# EasyEDA Pro project ProProject_FPGA Dev Board - ICE40HX4K-TQ144 v0.03_2024-02-22 - EASYEDA PRO PROJECT.epro, board PCB ICE40
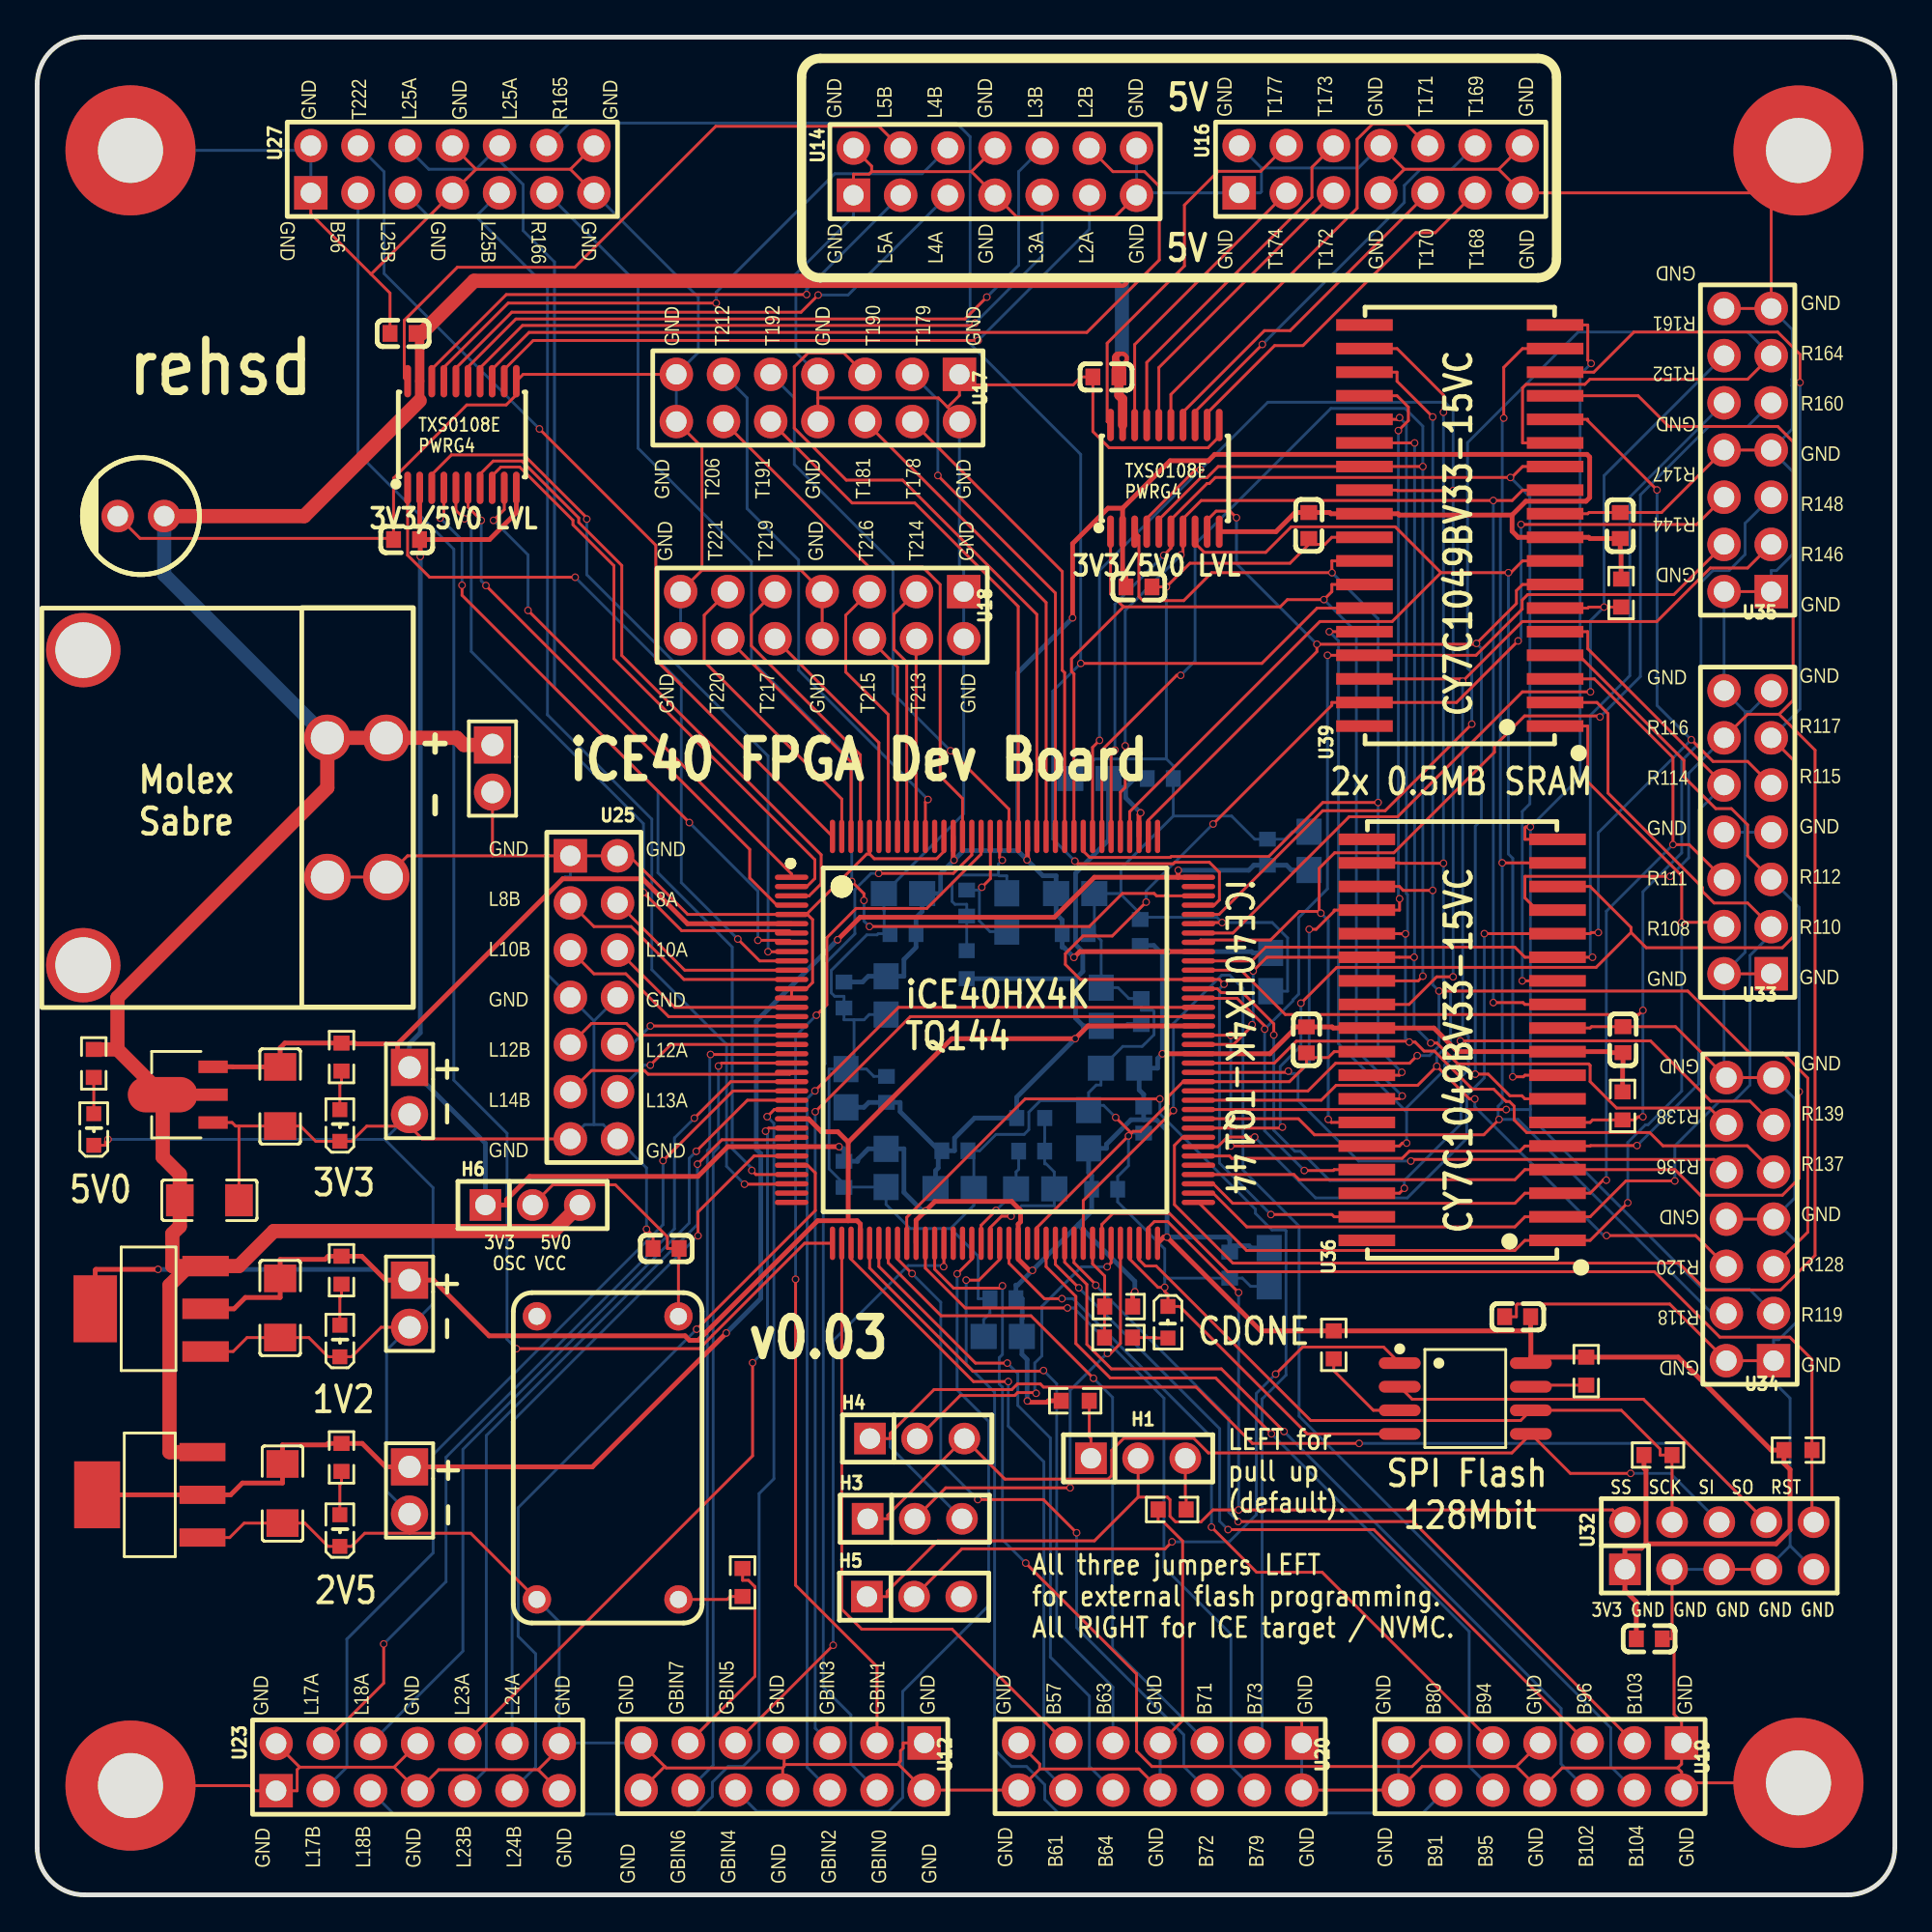
[diagram p1: board, top side]
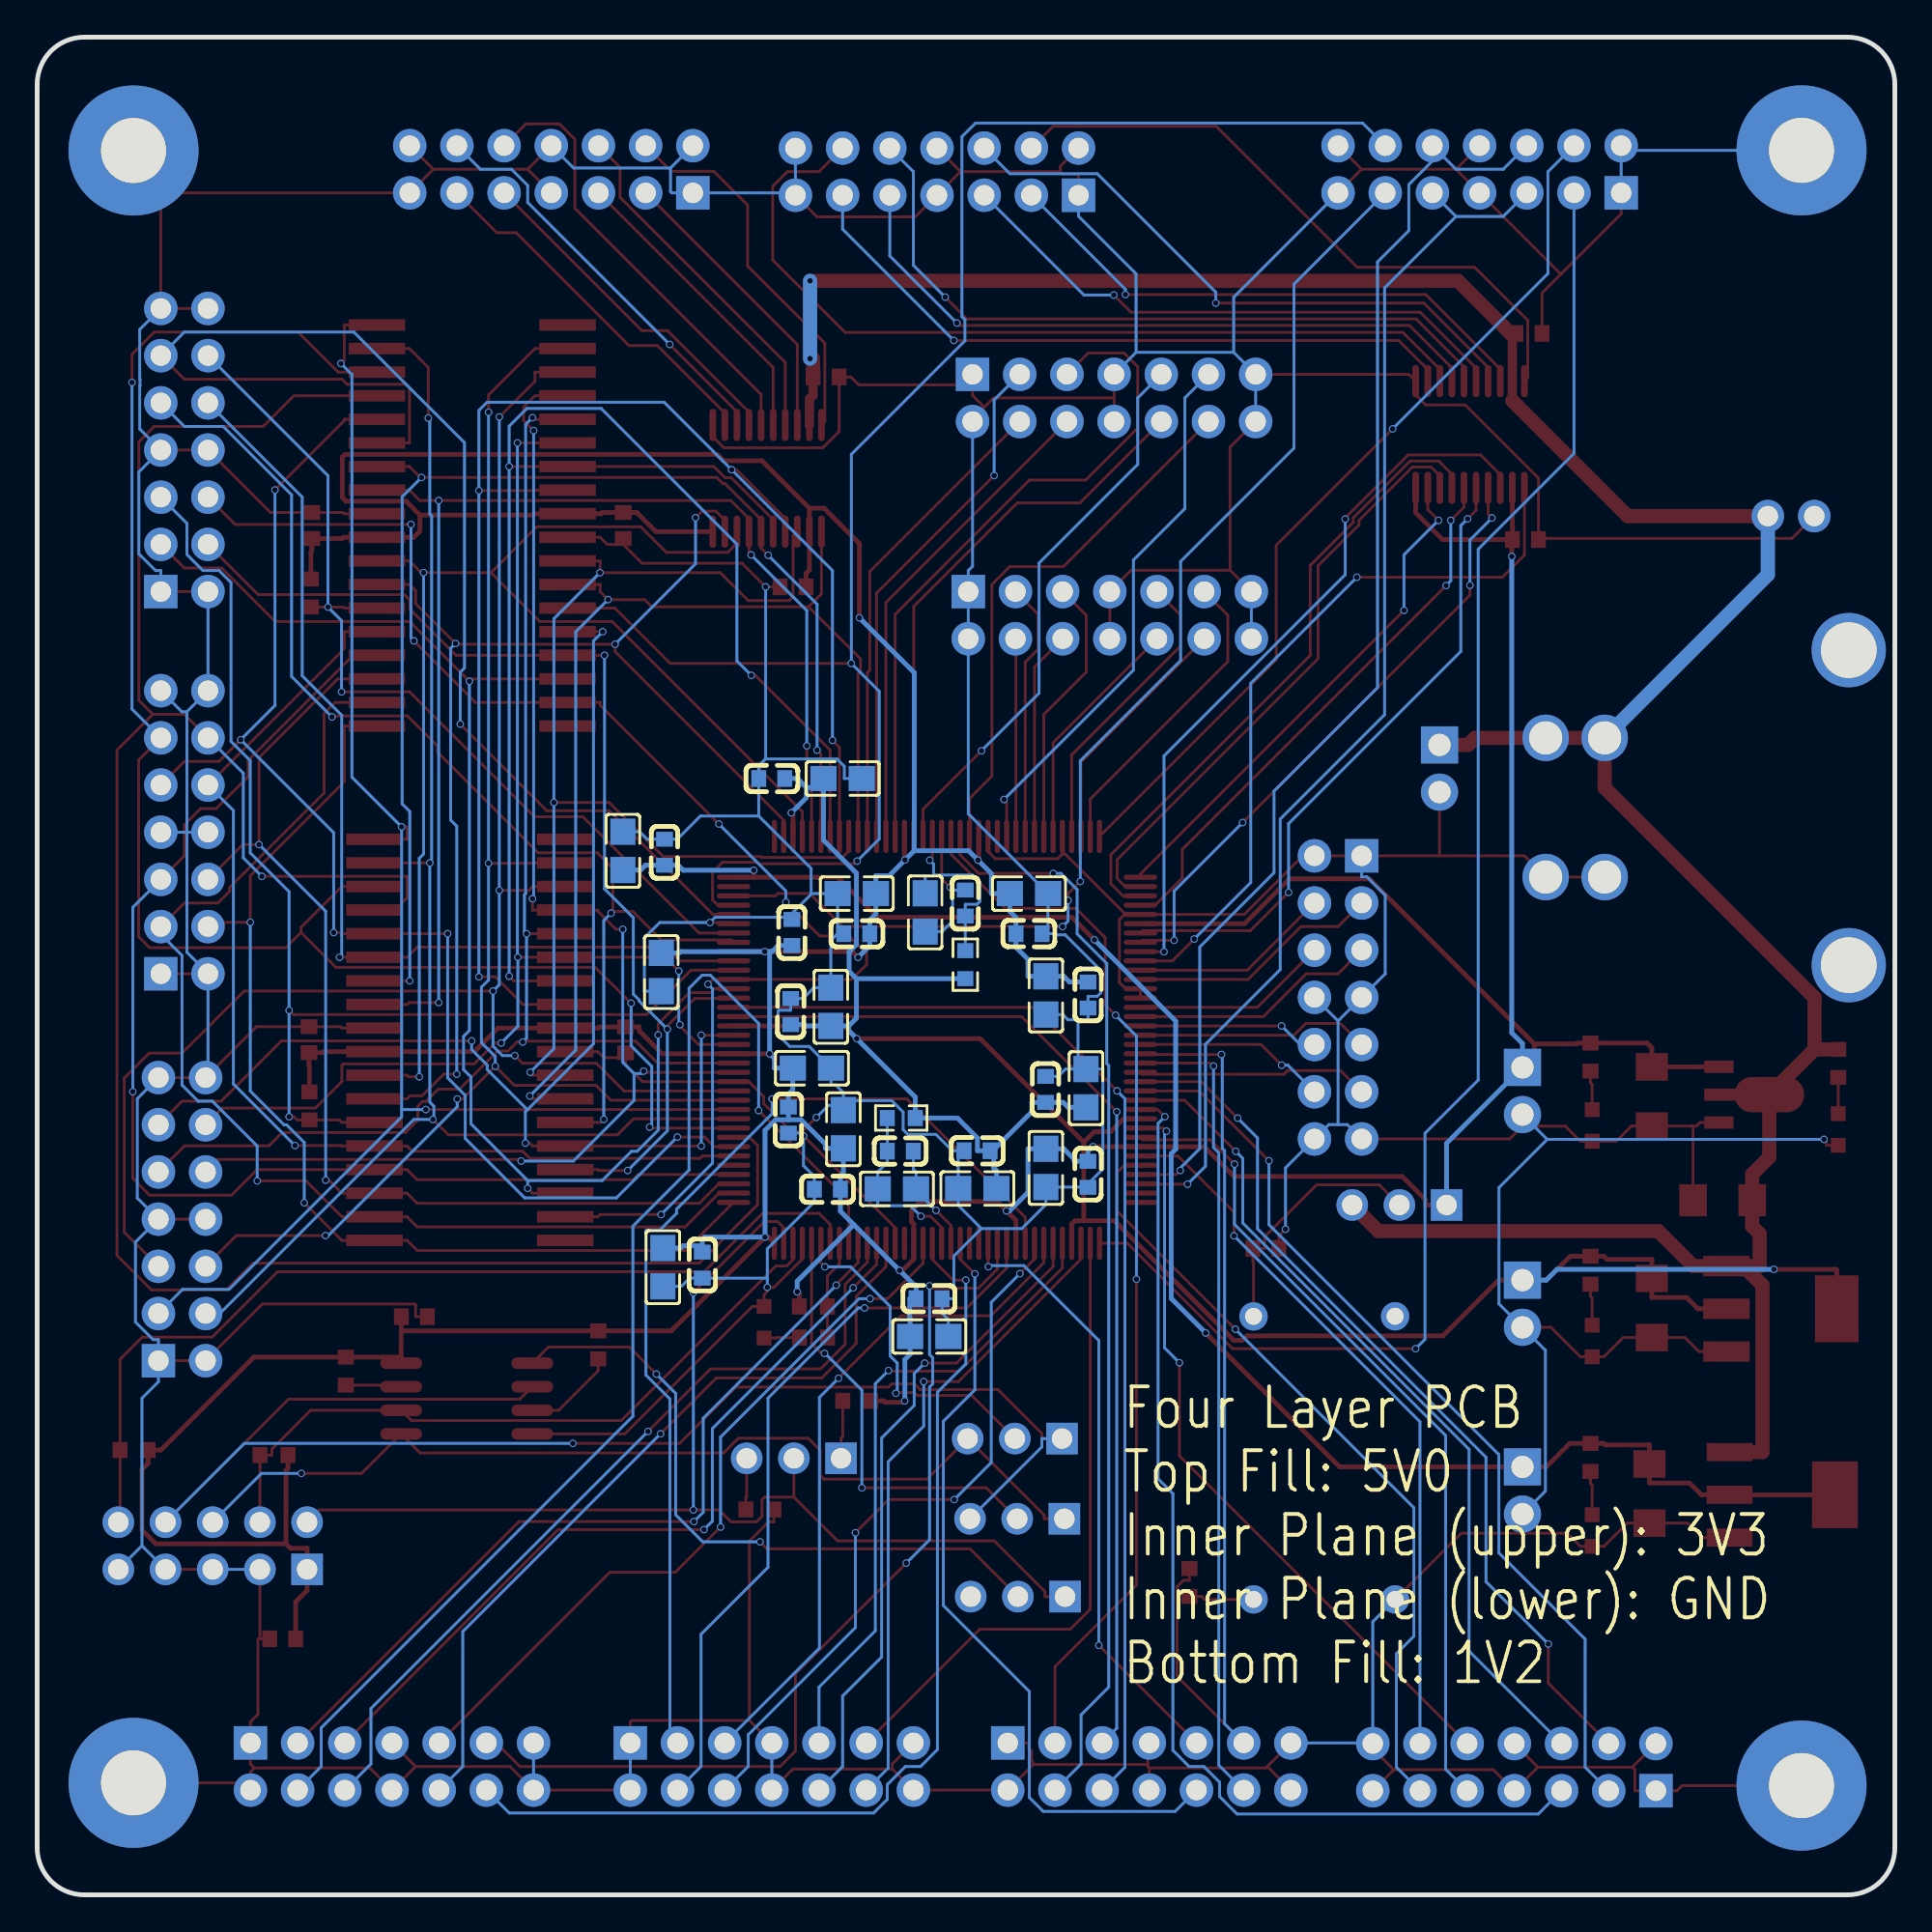
[diagram p2: board, bottom side, seen from below]

Outline 100 x 100 mm; copper layers: Top Layer, 3V3, GND, Bottom Layer. Coordinates in mm from the lower left corner of the outline.
Outline path: 0,97.46 0,2.54 arc(0.74,0.74) 2.54,0 97.46,0 arc(99.26,0.74) 100,2.54 100,97.46 arc(99.26,99.26) 97.46,100 2.54,100 arc(0.74,99.26) 0,97.46
Stack: Top Layer 0.035mm 外层铜厚1oz / Dielectric1 0.2104mm 7628 RC49% 8.6mil / 3V3 0.0152mm 内层铜厚 / Dielectric2 1.065mm 1.1mm H/HOZ 含铜 / GND 0.0152mm 内层铜厚 / Dielectric3 0.2104mm 7628 RC49% 8.6mil / Bottom Layer 0.035mm 外层铜厚1oz

## Design rules (mm)
template: Custom Config
spacing copperThickness1oz (default): track to track 0.152, other pairs 0.152 to 0.3
spacing copperThickness2oz: track to track 0.203, other pairs 0.152 to 0.3
track width copperThickness1oz (default): min 0.127, default 0.152, max 2.54
track width copperThickness2oz: min 0.203, default 0.254, max 2.54
track width 5V0: min 0.127, default 0.762, max 2.54
track width 3V3: min 0.127, default 0.254, max 2.54
track width 1V2: min 0.127, default 0.254, max 2.54
track width 2V5: min 0.127, default 0.254, max 2.54
differential pair differentialPair (default): width min 0.127, default 0.254, max 2.54; gap min 0.152, default 0.152
via viaSize (default): diameter min 0.4, default 0.4, max 10; hole min 0.3, default 0.3, max 6.3
net 3V3 uses 3V3
net 1V2 uses 1V2
net 2V5 uses 2V5
net 5V0 uses 5V0

## Placement (name value [footprint] x y rotation side)
C1  4.7uF  [C0805]  56.64 60.09 0 bottom
C2  0.1uF  [C0603]  60.46 60.09 0 bottom
C3  4.7uF  [C0805]  46.61 53.9 0 bottom
C4  0.1uF  [C0603]  46.61 51.74 180 bottom
C5  4.7uF  [C0805]  55.88 53.9 180 bottom
C6  0.1uF  [C0603]  55.88 51.74 0 bottom
C9  4.7uF  [C0805]  52.2 52.88 90 bottom
C10  0.1uF  [C0603]  50.04 53.39 90 bottom
C11  4.7uF  [C0805]  68.47 56.2 270 bottom
C12  0.1uF  [C0603]  66.23 56.13 90 bottom
C13  4.7uF  [C0805]  66.4 49.67 90 bottom
C14  0.1uF  [C0603]  59.37 51.81 90 bottom
C15  4.7uF  [C0805]  57.28 47.8 270 bottom
C16  0.1uF  [C0603]  59.44 47.55 90 bottom
C17  4.7uF  [C0805]  51.98 30.06 0 bottom
C18  0.1uF  [C0603]  51.99 32.09 180 bottom
C19  4.7uF  [C0805]  56.6 41.21 270 bottom
C20  0.1uF  [C0603]  57.46 37.99 0 bottom
C21  4.7uF  [C0805]  53.72 38 0 bottom
C22  0.1uF  [C0603]  53.53 40.04 180 bottom
C23  4.7uF  [C0805]  58.29 44.5 0 bottom
C24  0.1uF  [C0603]  59.56 41.71 270 bottom
C25  4.7uF  [C0805]  49.39 38.03 180 bottom
C26  0.1uF  [C0603]  49.4 40.06 0 bottom
C27  4.7uF  [C0805]  45.7 48.42 90 bottom
C28  0.1uF  [C0603]  43.43 48.44 270 bottom
C29  4.7uF  [C0805]  43.54 43.42 270 bottom
C30  0.1uF  [C0603]  45.72 43.36 90 bottom
C31  4.7uF  [C0805]  45.7 39.13 90 bottom
C32  0.1uF  [C0603]  43.43 38.79 270 bottom
C33  10uF  [C1206]  9.27 37.39 0 top
C34  10uF  [C1206]  13.08 42.98 270 top
C35  0.1uF  [C0603]  86.78 13.78 0 top
C36  10uF  [C1206]  13.08 31.59 270 top
C37  10uF  [C1206]  13.21 21.6 270 top
C38  0.1uF  [C0603]  79.69 31.12 180 top
C39  4.7uF  [C0805]  66.32 33.79 90 bottom
C40  0.1uF  [C0603]  64.2 33.9 270 bottom
C41  0.1uF  [C0603]  19.89 72.96 180 top
C42  0.1uF  [C0603]  19.69 84.05 180 top
C43  0.1uF  [C0603]  59.31 70.41 0 top
C44  0.1uF  [C0603]  57.53 81.71 180 top
C45  0.1uF  [C0603]  68.33 46.02 270 top
C46  0.1uF  [C0603]  85.37 46.04 90 top
C47  0.1uF  [C0603]  33.86 34.8 180 top
C48  0.1uF  [C0603]  68.45 73.71 270 top
C49  0.1uF  [C0603]  85.22 73.71 90 top
H1  JMPR  [HDR-TH_3P-P2.54-V-M]  59.27 23.5 0 top
H3  JMPR  [HDR-TH_3P-P2.54-V-M]  47.24 20.24 0 top
H4  JMPR  [HDR-TH_3P-P2.54-V-M]  47.37 24.56 0 top
H5  JMPR  [HDR-TH_3P-P2.54-V-M]  47.21 16.05 0 top
H6  JMPR  [HDR-TH_3P-P2.54-V-M]  26.67 37.14 0 top
LED1  -  [LED0603-R-RD]  3.05 41.2 90 top
LED2  -  [LED0603-R-RD]  16.29 41.42 90 top
LED3  -  [LED0603-R-RD]  16.29 29.81 90 top
LED4  -  [LED0603-R-RD]  16.29 19.61 90 top
LED5  -  [LED0603-R-RD]  60.87 30.82 270 top
R1  100  [R0603]  50.04 50.07 90 bottom
R2  100  [R0603]  53.48 41.82 0 bottom
R3  660  [R0603]  16.38 45.1 90 top
R4  1K  [R0603]  3.05 44.76 270 top
R5  220  [R0603]  16.38 33.62 270 top
R6  330  [R0603]  16.38 23.55 270 top
R7  4.7K  [R0603]  87.25 23.67 180 top
R8  10K  [R0603]  94.78 23.94 180 top
R9  10K  [R0603]  55.88 26.59 180 top
R10  10K  [R0603]  61.1 20.74 0 top
R11  10K  [R0603]  58.22 31.67 0 top
R12  10K  [R0603]  83.39 28.19 270 top
R13  10K  [R0603]  69.8 29.61 270 top
R14  1K  [R0603]  58.21 30 180 top
R15  10K  [R0603]  85.34 42.47 90 top
R16  10  [R0603]  37.97 16.81 90 top
R17  10K  [R0603]  85.26 70.08 90 top
U1  -  [TQFP-144_L20.0-W20.0-P0.50-LS22.0-BL]  51.56 46.03 270 top
U2  -  [Sabre 2-pin]  0.13 47.68 0 top
U3  HT7333-A  [SOT-89-3_L4.5-W2.5-P1.50-LS4.2-BR]  8.12 43.07 0 top
U4  2.54-1*2  [HDR-TH_2P-P2.54-V-M]  24.51 60.63 270 top
U5  2.54-1*2  [HDR-TH_2P-P2.54-V-M]  20.05 43.27 270 top
U6  AZ1117CH-1.2TRG1  [SOT-223-3_L6.5-W3.4-P2.30-LS7.0-BR]  6.1 31.55 0 top
U7  AMS1117-2.5(SOT-223)  [SOT-223-4_L6.5-W3.5-P2.30-LS7.0-BR]  6.06 21.53 0 top
U8  2.54-1*2  [HDR-TH_2P-P2.54-V-M]  20.05 31.82 270 top
U9  2.54-1*2  [HDR-TH_2P-P2.54-V-M]  20.05 21.77 270 top
U11  W25Q128JVSIQ  [SOIC-8_L5.3-W5.3-P1.27-LS8.0-BL]  76.88 26.72 270 top
U12  PZ2.54-2*7  [HDR-TH_14P-P2.54-V-M-R2-C7-S2.54-1]  40.13 6.91 180 top
U13  TXS0108EPWRG4  [TSSOP-20_L6.5-W4.4-P0.65-LS6.5-BL]  22.87 78.61 0 top
U14  PZ2.54-2*7  [HDR-TH_14P-P2.54-V-M-R2-C7-S2.54-1]  51.56 92.76 0 top
U15  TXS0108EPWRG4  [TSSOP-20_L6.5-W4.4-P0.65-LS6.5-BL]  60.71 76.25 0 top
U16  PZ2.54-2*7  [HDR-TH_14P-P2.54-V-M-R2-C7-S2.54-1]  72.32 92.89 0 top
U17  PZ2.54-2*7  [HDR-TH_14P-P2.54-V-M-R2-C7-S2.54-1]  42.03 80.58 180 top
U18  PZ2.54-2*7  [HDR-TH_14P-P2.54-V-M-R2-C7-S2.54-1]  42.26 68.89 180 top
U19  PZ2.54-2*7  [HDR-TH_14P-P2.54-V-M-R2-C7-S2.54-1]  80.9 6.91 180 top
U20  PZ2.54-2*7  [HDR-TH_14P-P2.54-V-M-R2-C7-S2.54-1]  60.45 6.91 180 top
U23  PZ2.54-2*7  [HDR-TH_14P-P2.54-V-M-R2-C7-S2.54-1]  20.48 6.87 0 top
U25  PZ2.54-2*7  [HDR-TH_14P-P2.54-V-M-R2-C7-S2.54-1]  29.97 48.31 270 top
U27  PZ2.54-2*7  [HDR-TH_14P-P2.54-V-M-R2-C7-S2.54-1]  22.35 92.89 0 top
U28  -  [Standoff 3.5mm]  94.81 6.03 0 top
U29  -  [Standoff 3.5mm]  5.02 93.91 0 top
U30  -  [Standoff 3.5mm]  94.81 93.9 0 top
U31  -  [Standoff 3.5mm]  5.02 5.88 0 top
U32  146262-5  [HDR-TH_10P-P2.54-V-M-R2-C5-S2.54]  90.55 18.79 0 top
U33  PZ2.54-2*7  [HDR-TH_14P-P2.54-V-M-R2-C7-S2.54-1]  92.08 57.2 90 top
U34  PZ2.54-2*7  [HDR-TH_14P-P2.54-V-M-R2-C7-S2.54-1]  92.2 36.37 90 top
U35  PZ2.54-2*7  [HDR-TH_14P-P2.54-V-M-R2-C7-S2.54-1]  92.08 77.78 90 top
U36  CY7C1049BV33-15VC  [SOJ-36_L23.5-W10.2-P1.27-LS11.2-BL]  76.71 46.03 90 top
U37  -  [Oscillator Full TH]  26.9 31.14 270 top
U38  100uF  [CAP-TH_BD6.3-P2.50-D0.6-FD]  5.59 74.22 180 top
U39  CY7C1049BV33-15VC  [SOJ-36_L23.5-W10.2-P1.27-LS11.2-BL]  76.58 73.71 90 top

## Footprints (pads in the part's own frame, mm; a bottom-side part is the same pattern mirrored in y, then rotated)
C0603
  rect 0.8x0.9 smd: 1(-0.7,0) 2(0.7,0)
C0805
  rect 1.41x1.35 smd: 1(-1.03,0) 2(1.03,0)
C1206
  rect 1.485x1.728 smd: 1(-1.593,0) 2(1.593,0)
CAP-TH_BD6.3-P2.50-D0.6-FD
  round 1.75 hole 1.1: 1(-1.25,0) 2(1.25,0)
HDR-TH_2P-P2.54-V-M
  rect 2x2 hole 1.2: 1(-1.27,0)
  round 2 hole 1.2: 2(1.27,0)
HDR-TH_3P-P2.54-V-M
  rect 1.7x1.7 hole 1.1: 1(-2.54,0)
  round 1.7 hole 1.1: 2(0,0) 3(2.54,0)
HDR-TH_10P-P2.54-V-M-R2-C5-S2.54
  rect 1.7x1.7 hole 1.1: 1(-5.08,-1.27)
  round 1.7 hole 1.1: 2(-5.08,1.27) 3(-2.54,-1.27) 4(-2.54,1.27) 5(0,-1.27) 6(0,1.27) 7(2.54,-1.27) 8(2.54,1.27) 9(5.08,-1.27) 10(5.08,1.27)
HDR-TH_14P-P2.54-V-M-R2-C7-S2.54-1
  rect 1.8x1.8 hole 1.1: 1(-7.62,-1.27)
  round 1.8 hole 1.1: 2(-7.62,1.27) 3(-5.08,-1.27) 4(-5.08,1.27) 5(-2.54,-1.27) 6(-2.54,1.27) 7(0,-1.27) 8(0,1.27) 9(2.54,-1.27) 10(2.54,1.27) 11(5.08,-1.27) 12(5.08,1.27) 13(7.62,-1.27) 14(7.62,1.27)
LED0603-R-RD
  rect 0.8x0.8 smd: 1(0.851,0) 2(-0.851,0)
Oscillator Full TH
  round 1.524 hole 0.914: 1(0,0) 2(15.24,0) 3(15.24,7.62) 4(0.005,7.62)
R0603
  rect 0.806x0.864 smd: 1(-0.753,0) 2(0.753,0)
Sabre 2-pin
  round 2.5 hole 1.78: 1(15.494,14.605) 1(18.669,14.605) 2(15.494,7.112) 2(18.669,7.112)
  round 4 hole 3: 3(2.354,19.328) 4(2.354,2.368)
SOIC-8_L5.3-W5.3-P1.27-LS8.0-BL
  oval 0.63x2.25 smd: 1(-1.905,-3.53) 2(-0.635,-3.53) 3(0.635,-3.53) 4(1.905,-3.53) 5(1.905,3.53) 6(0.635,3.53) 7(-0.635,3.53) 8(-1.905,3.53)
SOJ-36_L23.5-W10.2-P1.27-LS11.2-BL
  rect 0.623x3.045 smd: 1(-10.795,-5.133) 2(-9.525,-5.133) 3(-8.255,-5.133) 4(-6.985,-5.133) 5(-5.715,-5.133) 6(-4.445,-5.133) 7(-3.175,-5.133) 8(-1.905,-5.133) 9(-0.635,-5.133) 10(0.635,-5.133) 11(1.905,-5.133) 12(3.175,-5.133) 13(4.445,-5.133) 14(5.715,-5.133) 15(6.985,-5.133) 16(8.255,-5.133) 17(9.525,-5.133) 18(10.795,-5.133) 19(10.795,5.133) 20(9.525,5.133) 21(8.255,5.133) 22(6.985,5.133) 23(5.715,5.133) 24(4.445,5.133) 25(3.175,5.133) 26(1.905,5.133) 27(0.635,5.133) 28(-0.635,5.133) 29(-1.905,5.133) 30(-3.175,5.133) 31(-4.445,5.133) 32(-5.715,5.133) 33(-6.985,5.133) 34(-8.255,5.133) 35(-9.525,5.133) 36(-10.795,5.133)
SOT-89-3_L4.5-W2.5-P1.50-LS4.2-BR
  rect 1.575x0.672 smd: 1(1.356,-1.5) 3(1.356,1.5)
  custom 5.377x1.9 smd: 2(-1.356,0)
SOT-223-3_L6.5-W3.4-P2.30-LS7.0-BR
  rect 2.5x1.1 smd: 1(2.97,-2.3) 2(2.97,0) 3(2.97,2.3)
  rect 2.34x3.6 smd: 4(-2.97,0)
SOT-223-4_L6.5-W3.5-P2.30-LS7.0-BR
  rect 2.47x0.98 smd: 1(2.835,-2.3) 2(2.835,0) 3(2.835,2.3)
  rect 2.47x3.6 smd: 4(-2.835,0)
Standoff 3.5mm
  round 7 hole 3.5: 1(0,0)
TQFP-144_L20.0-W20.0-P0.50-LS22.0-BL
  oval 0.28x1.8 smd: 1(-8.75,-10.95) 2(-8.25,-10.95) 3(-7.75,-10.95) 4(-7.25,-10.95) 5(-6.75,-10.95) 6(-6.25,-10.95) 7(-5.75,-10.95) 8(-5.25,-10.95) 9(-4.75,-10.95) 10(-4.25,-10.95) 11(-3.75,-10.95) 12(-3.25,-10.95) 13(-2.75,-10.95) 14(-2.25,-10.95) 15(-1.75,-10.95) 16(-1.25,-10.95) 17(-0.75,-10.95) 18(-0.25,-10.95) 19(0.25,-10.95) 20(0.75,-10.95) 21(1.25,-10.95) 22(1.75,-10.95) 23(2.25,-10.95) 24(2.75,-10.95) 25(3.25,-10.95) 26(3.75,-10.95) 27(4.25,-10.95) 28(4.75,-10.95) 29(5.25,-10.95) 30(5.75,-10.95) 31(6.25,-10.95) 32(6.75,-10.95) 33(7.25,-10.95) 34(7.75,-10.95) 35(8.25,-10.95) 36(8.75,-10.95) 73(8.75,10.95) 74(8.25,10.95) 75(7.75,10.95) 76(7.25,10.95) 77(6.75,10.95) 78(6.25,10.95) 79(5.75,10.95) 80(5.25,10.95) 81(4.75,10.95) 82(4.25,10.95) 83(3.75,10.95) 84(3.25,10.95) 85(2.75,10.95) 86(2.25,10.95) 87(1.75,10.95) 88(1.25,10.95) 89(0.75,10.95) 90(0.25,10.95) 91(-0.25,10.95) 92(-0.75,10.95) 93(-1.25,10.95) 94(-1.75,10.95) 95(-2.25,10.95) 96(-2.75,10.95) 97(-3.25,10.95) 98(-3.75,10.95) 99(-4.25,10.95) 100(-4.75,10.95) 101(-5.25,10.95) 102(-5.75,10.95) 103(-6.25,10.95) 104(-6.75,10.95) 105(-7.25,10.95) 106(-7.75,10.95) 107(-8.25,10.95) 108(-8.75,10.95)
  oval 1.8x0.28 smd: 37(10.95,-8.75) 38(10.95,-8.25) 39(10.95,-7.75) 40(10.95,-7.25) 41(10.95,-6.75) 42(10.95,-6.25) 43(10.95,-5.75) 44(10.95,-5.25) 45(10.95,-4.75) 46(10.95,-4.25) 47(10.95,-3.75) 48(10.95,-3.25) 49(10.95,-2.75) 50(10.95,-2.25) 51(10.95,-1.75) 52(10.95,-1.25) 53(10.95,-0.75) 54(10.95,-0.25) 55(10.95,0.25) 56(10.95,0.75) 57(10.95,1.25) 58(10.95,1.75) 59(10.95,2.25) 60(10.95,2.75) 61(10.95,3.25) 62(10.95,3.75) 63(10.95,4.25) 64(10.95,4.75) 65(10.95,5.25) 66(10.95,5.75) 67(10.95,6.25) 68(10.95,6.75) 69(10.95,7.25) 70(10.95,7.75) 71(10.95,8.25) 72(10.95,8.75) 109(-10.95,8.75) 110(-10.95,8.25) 111(-10.95,7.75) 112(-10.95,7.25) 113(-10.95,6.75) 114(-10.95,6.25) 115(-10.95,5.75) 116(-10.95,5.25) 117(-10.95,4.75) 118(-10.95,4.25) 119(-10.95,3.75) 120(-10.95,3.25) 121(-10.95,2.75) 122(-10.95,2.25) 123(-10.95,1.75) 124(-10.95,1.25) 125(-10.95,0.75) 126(-10.95,0.25) 127(-10.95,-0.25) 128(-10.95,-0.75) 129(-10.95,-1.25) 130(-10.95,-1.75) 131(-10.95,-2.25) 132(-10.95,-2.75) 133(-10.95,-3.25) 134(-10.95,-3.75) 135(-10.95,-4.25) 136(-10.95,-4.75) 137(-10.95,-5.25) 138(-10.95,-5.75) 139(-10.95,-6.25) 140(-10.95,-6.75) 141(-10.95,-7.25) 142(-10.95,-7.75) 143(-10.95,-8.25) 144(-10.95,-8.75)
TSSOP-20_L6.5-W4.4-P0.65-LS6.5-BL
  oval 0.364x1.742 smd: 1(-2.925,-2.871) 2(-2.275,-2.871) 3(-1.625,-2.871) 4(-0.975,-2.871) 5(-0.325,-2.871) 6(0.325,-2.871) 7(0.975,-2.871) 8(1.625,-2.871) 9(2.275,-2.871) 10(2.925,-2.871) 11(2.925,2.871) 12(2.275,2.871) 13(1.625,2.871) 14(0.975,2.871) 15(0.325,2.871) 16(-0.325,2.871) 17(-0.975,2.871) 18(-1.625,2.871) 19(-2.275,2.871) 20(-2.925,2.871)

## Nets
1V2: C1.2 C2.1 C15.2 C16.1 C25.2 C26.1 C29.2 C30.1 C36.1 R1.1 R2.1 R5.1 U1.27 U1.40 U1.92 U1.111 U6.2 U6.4 U8.1
2V5: C11.2 C12.1 C37.1 R6.1 U1.108 U7.2 U7.4 U9.1
3V3: C3.2 C4.1 C5.2 C6.1 C13.2 C14.1 C17.2 C18.1 C19.2 C20.1 C23.2 C24.1 C27.2 C28.1 C31.2 C32.1 C34.1 C35.1 C38.1 C39.2 C40.1 C41.1 C43.1 C45.1 C46.1 C48.1 C49.1 H6.1 R3.2 R7.2 R8.2 R9.2 R11.2 R12.1 R13.1 R15.2 R17.2 U1.6 U1.30 U1.46 U1.57 U1.72 U1.89 U1.100 U1.123 U1.131 U3.3 U5.1 U11.8 U13.2 U13.10 U15.2 U15.10 U32.1 U36.9 U36.27 U39.9 U39.27
5V0: C33.1 C42.1 C44.1 H6.3 R4.1 U2.1 U3.2 U4.1 U6.3 U7.3 U13.19 U15.19 U38.1
GND: C1.1 C2.2 C3.1 C4.2 C5.1 C6.2 C11.1 C12.2 C13.1 C14.2 C15.1 C16.2 C17.1 C18.2 C19.1 C20.2 C23.1 C24.2 C25.1 C26.2 C27.1 C28.2 C29.1 C30.2 C31.1 C32.2 C33.2 C34.2 C35.2 C36.2 C37.2 C38.2 C39.1 C40.2 C41.2 C42.2 C43.2 C44.2 C45.2 C46.2 C47.2 C48.2 C49.2 LED1.2 LED2.2 LED3.2 LED4.2 LED5.2 R10.1 U1.5 U1.13 U1.14 U1.59 U1.69 U1.86 U1.103 U1.132 U1.140 U2.2 U3.1 U4.2 U5.2 U6.1 U7.1 U8.2 U9.2 U11.4 U12.1 U12.2 U12.7 U12.8 U12.13 U12.14 U13.11 U14.1 U14.2 U14.7 U14.8 U14.13 U14.14 U15.11 U16.1 U16.2 U16.7 U16.8 U16.13 U16.14 U17.1 U17.2 U17.7 U17.8 U17.13 U17.14 U18.1 U18.2 U18.7 U18.8 U18.13 U18.14 U19.1 U19.2 U19.7 U19.8 U19.13 U19.14 U20.1 U20.2 U20.7 U20.8 U20.13 U20.14 U23.1 U23.2 U23.7 U23.8 U23.13 U23.14 U25.1 U25.2 U25.7 U25.8 U25.13 U25.14 U27.1 U27.2 U27.7 U27.8 U27.13 U27.14 U28.1 U29.1 U30.1 U31.1 U32.3 U32.5 U32.7 U32.9 U33.1 U33.2 U33.7 U33.8 U33.13 U33.14 U34.1 U34.2 U34.7 U34.8 U34.13 U34.14 U35.1 U35.2 U35.7 U35.8 U35.13 U35.14 U36.10 U36.28 U37.2 U38.2 U39.10 U39.28
CRESET_B: R8.1 U1.66 U32.10
GBIN0: U1.129 U12.4
GBIN1: U1.128 U12.3
GBIN2: U1.94 U12.6
GBIN3: U1.93 U12.5
GBIN4: U1.52 U12.10
GBIN5: U1.49 U12.9
GBIN6: U1.21 U12.12
GBIN7: R16.2 U1.20 U12.11
IOB_56: U1.37 U27.3
IOB_57: U1.38 U20.11
IOB_61: U1.39 U20.12
IOB_63: U1.41 U20.9
IOB_64: U1.42 U20.10
IOB_71: U1.43 U20.5
IOB_72: U1.44 U20.6
IOB_73: U1.45 U20.3
IOB_79: U1.47 U20.4
IOB_80: U1.48 U19.11
IOB_91: U1.55 U19.12
IOB_94: U1.56 U19.9
IOB_95: U1.60 U19.10
IOB_96: U1.61 U19.5
IOB_102: U1.62 U19.6
IOB_103: U1.63 U19.3
IOB_104: U1.64 U19.4
IOL_2A: U1.1 U13.9
IOL_2B: U1.2 U13.8
IOL_3A: U1.3 U13.7
IOL_3B: U1.4 U13.6
IOL_4A: U1.7 U13.5
IOL_4B: U1.8 U13.4
IOL_5A: U1.9 U13.3
IOL_5B: U1.10 U13.1
IOL_8A: U1.11 U25.4
IOL_8B: U1.12 U25.3
IOL_10A: U1.15 U25.6
IOL_10B: U1.16 U25.5
IOL_12A: U1.17 U25.10
IOL_12B: U1.18 U25.9
IOL_13A: U1.19 U25.12
IOL_14B: U1.22 U25.11
IOL_17A: U1.23 U23.4
IOL_17B: U1.24 U23.3
IOL_18A: U1.25 U23.6
IOL_18B: U1.26 U23.5
IOL_23A: U1.28 U23.10
IOL_23B: U1.29 U23.9
IOL_24A: U1.31 U23.12
IOL_24B: U1.32 U23.11
IOL_25A: U1.33 U27.6 U27.10
IOL_25B: U1.34 U27.5 U27.9
IOR_108: U1.73 U33.4 U36.1 U39.1
IOR_110: U1.74 U33.3 U36.2 U39.2
IOR_111: U1.75 U33.6 U36.3 U39.3
IOR_112: U1.76 U33.5 U36.4 U39.4
IOR_114: U1.78 U33.10 U36.5 U39.5
IOR_115: U1.79 U33.9 U36.14 U39.14
IOR_116: U1.80 U33.12 U36.15 U39.15
IOR_117: U1.81 U33.11 U36.16 U39.16
IOR_118: U1.82 U34.4 U36.17 U39.17
IOR_119: U1.83 U34.3 U36.18 U39.18
IOR_120: U1.84 U34.6 U36.20 U39.20
IOR_128: U1.85 U34.5 U36.21 U39.21
IOR_136: U1.87 U34.10 U36.22 U39.22
IOR_137: U1.88 U34.9 U36.23 U39.23
IOR_138: U1.90 U34.12 U36.24 U39.24
IOR_139: U1.91 U34.11 U36.32 U39.32
IOR_144: U1.95 U35.4 U36.33 U39.33
IOR_146: U1.96 U35.3 U36.34 U39.34
IOR_147: U1.97 U35.6 U36.35 U39.35
IOR_148: R15.1 U1.98 U35.5 U36.6
IOR_152: U1.99 U35.10 U36.13
IOR_160: U1.101 U35.9 U36.31
IOR_161: R17.1 U1.102 U35.12 U39.6
IOR_164: U1.104 U35.11 U39.13
IOR_165: U1.105 U27.12 U39.31
IOR_166: U1.106 U27.11
IOT168: U1.110 U15.9 U36.7 U39.7
IOT169: U1.112 U15.8 U36.8 U39.8
IOT170: U1.113 U15.7 U36.11 U39.11
IOT171: U1.114 U15.6 U36.12 U39.12
IOT172: U1.115 U15.5 U36.25 U39.25
IOT173: U1.116 U15.4 U36.26 U39.26
IOT174: U1.117 U15.3 U36.29 U39.29
IOT177: U1.118 U15.1 U36.30 U39.30
IOT178: U1.119 U17.4
IOT179: U1.120 U17.3
IOT181: U1.121 U17.6
IOT190: U1.122 U17.5
IOT191: U1.124 U17.10
IOT192: U1.125 U17.9
IOT206: U1.130 U17.12
IOT212: U1.134 U17.11
IOT213: U1.135 U18.4
IOT214: U1.136 U18.3
IOT215: U1.137 U18.6
IOT216: U1.138 U18.5
IOT217: U1.139 U18.10
IOT219: U1.141 U18.9
IOT220: U1.142 U18.12
IOT221: U1.143 U18.11
IOT222: U1.144 U27.4
SPI_SCK: R7.1 U1.70 U11.6 U32.4
SPI_SI: H3.1 H4.3 U11.5 U32.6
SPI_SO: H3.3 H4.1 U11.2 U32.8
SPI_SS_B: H1.2 H5.1 U1.71 U32.2
$1N2048: C9.2 C10.1 R1.2 U1.126
$1N2061: C9.1 C10.2 U1.127
$1N2767: C21.2 C22.1 R2.2 U1.54
$1N2772: C21.1 C22.2 U1.53
$1N3621: LED1.1 R4.2
$1N3623: LED2.1 R3.1
$1N4030: LED3.1 R5.2
$1N4120: LED4.1 R6.2
$1N5384: H1.1 R9.1
$1N5387: H1.3 R10.2
$1N5440: H4.2 U1.67
$1N5452: H3.2 U1.68
$1N5672: H5.2 U11.1
$1N5724: R12.2 U11.7
$1N7458: U13.20 U14.4
$1N7463: U13.18 U14.3
$1N7473: U13.17 U14.6
$1N7478: U13.16 U14.5
$1N7488: U13.15 U14.10
$1N7505: U13.14 U14.9
$1N7510: U13.13 U14.12
$1N7517: U13.12 U14.11
$1N7832: U15.20 U16.4
$1N7836: U15.18 U16.3
$1N7840: U15.17 U16.6
$1N7844: U15.16 U16.5
$1N7848: U15.15 U16.10
$1N7854: U15.14 U16.9
$1N7858: U15.13 U16.12
$1N7864: U15.12 U16.11
$1N11715: R13.2 U11.3
$1N13582: LED5.1 R14.1
$1N13617: R11.1 R14.2 U1.65
$1N14467: C47.1 H6.2 U37.4
$1N14519: R16.1 U37.3

Pads without a net: H5 3; U1 35 36 50 51 58 77 107 109 133; U2 3 4; U36 19 36; U37 1; U39 19 36

## Via types
v1: diameter 0.402, hole 0.299, Top Layer to Bottom Layer, 214 vias

## Routing (per net, layer and track width the routed paths; a pad name or vN(x,y) marks a point on that pad's centre or on a via; arc(x,y) is an arc through that point)
1V2: length 141
  Top Layer w0.254: 59.31,56.97 59.31,58.16 v1(59.4,58.25) ; 43.66,36.29 44.14,36.29 44.31,36.11 44.31,35.08 ; 43.66,36.29 42.01,36.29 35.98,30.26 35.98,30.25 35.59,29.85 35.12,29.85 34.88,30.09 24.33,30.09 21.33,33.09 U8.1 18.76,33.09 17.48,34.38 R5.1 15.67,34.38 15.5,34.21 13.08,34.21 13.08,32.16 11.21,32.16 10.6,31.55 U6.2 ; 43.66,36.29 43.66,40.52 ; 43.66,40.52 43.1,41.08 42.22,41.08 41.52,41.78 U1.27 ; 43.66,40.52 49.23,46.09 v1(55.88,46.09) 56.57,46.77 62.51,46.77 ; v1(6.51,33.67) 3.17,33.67 3.13,33.63 U6.4
  Bottom Layer w0.254: 58.6,59.61 58.6,59.06 v1(59.4,58.25) ; 58.6,59.61 59.07,60.09 59.76,60.09 ; 58.6,59.61 57.67,59.61 ; 55.9,49.32 50.04,49.32 ; 55.9,49.32 56.29,49.71 56.29,50.76 55.9,51.15 55.9,55 57.67,56.77 57.67,59.61 ; 55.9,49.32 55.9,47.19 56.32,46.77 ; 56.32,46.77 56.32,46.53 v1(55.88,46.09) 52.73,42.94 52.73,41.82 50.46,41.82 49.39,40.74 49.39,40.06 48.55,40.06 ; 56.32,46.77 58.63,46.77 58.7,46.85 C16.1 ; 57.67,59.61 57.67,60.09 ; U8.1 18.76,33.09 18.18,33.67 v1(6.51,33.67) ; 43.54,42.39 44.5,42.39 44.77,42.66 46.45,42.66 46.45,42.16 48.55,40.06 ; 48.55,40.06 48.51,40.06 48.51,39.13 48.36,38.98 C25.2
2V5: length 92
  Top Layer w0.254: 61.43,54.78 56.91,54.78 54.76,52.62 44.3,52.62 v1(43.09,51.41) ; 61.43,54.78 v1(61.43,55.15) ; 61.43,54.78 U1.108 ; v1(37.09,30.25) 29.89,23.04 U9.1 18.76,23.04 17.5,24.3 R6.1 15.67,24.3 15.59,24.22 13.21,24.22 13.21,22.17 11.05,22.17 10.42,21.53 3.23,21.53
  Bottom Layer w0.254: v1(61.43,55.15) 65.22,55.15 65.49,55.43 C12.1 67.25,55.43 67.51,55.17 68.47,55.17 ; v1(37.09,30.25) 38.95,32.11 38.95,39.9 38.71,40.14 38.71,47.04 v1(43.09,51.41)
3V3: length 393.3
  Top Layer w0.254: 85.26,70.83 85.26,72.28 85.22,72.33 85.22,73.01 83.59,73.01 83.52,73.08 U39.9 79.73,73.08 79.4,73.41 79.4,74.27 ; v1(49.35,55.7) 49.31,55.74 49.31,56.97 ; 86.6,18.9 86.6,22.86 86.5,22.96 86.5,23.68 ; 86.6,18.9 93.61,18.9 94.36,19.64 94.36,22.9 94.03,23.23 94.03,23.94 93.34,23.94 88.34,28.95 R12.1 80.41,28.95 ; 86.6,18.9 86.36,18.66 85.47,18.66 85.47,16.39 86.08,15.77 86.08,13.78 ; 58.43,74.64 58.43,71.32 58.61,71.14 C43.1 ; 58.43,74.64 60.99,77.2 63.05,77.2 63.39,77.54 83.43,77.54 83.57,77.39 83.57,75.22 83.37,75.02 80.13,75.02 79.4,74.27 ; 58.43,74.64 57.64,74.64 55.74,72.74 v1(55.74,68.74) ; 19.4,45.81 28.29,54.69 32.59,54.69 35.01,52.28 U1.6 ; 19.4,45.81 17.14,45.81 17.1,45.85 R3.2 13.34,45.85 13.08,45.6 C34.1 10.55,44.57 10.54,44.57 U3.3 ; 19.4,45.81 19.4,44.54 U5.1 ; U15.10 66.69,73.38 67.72,74.41 C48.1 69.58,74.41 69.64,74.35 U39.27 73.25,74.35 73.32,74.27 79.4,74.27 ; U13.2 20.59,73.7 20.58,73.69 C41.1 20.92,72.96 ; R11.2 58.97,32.39 59.01,32.39 v1(59.09,32.46) ; 85.34,43.22 85.34,44.63 85.37,44.65 85.37,45.34 84.63,45.34 84.58,45.39 76.46,45.39 75.19,46.66 69.77,46.66 69.71,46.72 67.59,46.72 67.59,46.51 66.36,45.28 U1.89 v1(60.57,45.28) ; 62.51,50.77 v1(60.84,50.77) 56.12,50.77 v1(55.81,50.46) ; 20.92,72.96 20.62,72.65 v1(20.62,72.05) ; 20.92,72.96 24.35,72.96 25.79,74.4 25.79,75.74 ; 80.41,28.62 80.41,28.95 ; 80.41,28.95 80.41,30.35 80.39,30.36 ; 60.31,35.08 60.64,35.41 v1(60.82,35.41) 65.87,30.36 80.39,30.36 ; v1(53.3,26.59) 53.38,26.52 54.36,26.52 54.44,26.59 R9.2 ; 53.31,56.97 53.31,55.74 v1(53.28,55.71) ; H6.1 25.27,37.14 25.27,37.42 26.52,38.67 35.57,38.67 37.17,40.27 v1(43.17,40.27) ; 80.39,30.36 C38.1 ; 47.31,35.08 47.31,36.31 v1(47.82,36.82) 48.33,37.33 52.45,37.33 52.94,36.84 52.94,36.23 52.81,36.11 52.81,34.22 53.41,33.61 v1(53.58,33.61)
  Bottom Layer w0.254: H6.1 24.13,40.46 U5.1 20.05,45.83 20.62,46.4 v1(20.62,72.05) ; 56.04,36.08 v1(53.58,33.61) 52.78,32.82 52.69,32.82 52.69,32.09 53.03,32.09 53.03,31.04 53.01,31.02 53.01,29.1 53.29,28.82 53.29,26.6 v1(53.3,26.59) ; 56.04,36.08 59.09,33.03 v1(59.09,32.46) ; 56.04,36.08 56.76,36.8 56.76,38.72 56.6,38.88 56.6,40.18 57.56,40.18 57.56,40.41 58.88,41.72 59.56,41.72 ; 59.56,41.72 60.25,41.72 60.82,41.15 v1(60.82,35.41) 64.07,35.41 64.2,35.28 64.2,34.94 ; 59.56,41.72 C24.1 59.56,43.09 59.32,43.33 C23.2 60.31,44.5 60.31,45.02 v1(60.57,45.28) 60.57,50.77 ; C13.2 65.44,50.7 65.37,50.77 v1(60.84,50.77) 60.57,50.77 ; 64.2,34.94 C40.1 ; 64.2,34.94 65.24,34.94 65.36,34.82 C39.2 ; v1(43.17,40.27) 43.27,40.17 43.43,40.17 43.43,39.49 44.17,39.49 44.17,39.59 44.74,40.16 C31.2 46.66,40.16 46.66,37.82 47.65,36.82 v1(47.82,36.82) ; v1(55.81,50.46) 55.26,51.01 55.18,51.01 C6.1 55.18,52.47 54.85,52.8 54.85,54.86 54.14,54.86 v1(53.28,55.71) 52.79,56.21 ; 60.57,50.77 60.44,50.77 60.11,51.11 59.38,51.11 ; 52.79,56.21 52.79,65.79 v1(55.74,68.74) ; 52.79,56.21 49.86,56.21 v1(49.35,55.7) 48.63,54.98 48.63,53.9 C3.2 47.64,52.94 47.31,52.61 47.31,51.01 46.66,50.36 46.66,49.45 C27.2 44.74,49.45 44.43,49.14 43.43,49.14
5V0: length 163.2
  Top Layer w0.5: 20.59,80.43 U13.19 20.59,84 20.54,84.05 ; 58.23,81.71 58.23,80.72 58.43,80.52 58.43,79.12
  Top Layer w0.762: C42.1 20.69,84.05 23.52,86.88 v1(58.39,86.88) ; R4.1 4.32,45.51 ; 4.32,45.51 4.32,48.3 15.62,59.59 15.62,62.28 22.59,62.28 22.97,61.9 U4.1 ; 4.32,45.51 U3.2 6.76,39.71 7.68,38.79 C33.1 7.68,35.99 7.28,35.59 7.28,33.85 8.16,33.85 ; U38.1 14.38,74.22 20.59,80.43 ; v1(58.39,82.7) 58.23,82.7 58.23,81.71 ; 8.16,33.85 U6.3 10.85,33.85 12.74,35.73 27.81,35.73 H6.3 ; 8.16,33.85 7.12,32.81 7.12,23.83 8.9,23.83
  Bottom Layer w0.762: 15.62,62.28 6.84,71.06 U38.1 ; v1(58.39,82.7) v1(58.39,86.88)
GND: length 923.2
  Top Layer w0.152: 8.9,19.23 10.37,19.23 11.14,20.01 C37.2 14.41,20.01 15.66,18.76 LED4.2 16.93,18.76 17.63,19.46 20.05,19.46 ; 44.81,56.03 45.06,55.78 48.42,55.78 48.81,56.16 48.81,56.97 ; 44.81,56.03 44.81,56.97 ; 44.81,56.03 44.66,56.03 41.46,52.83 41.46,52.78 ; 14.13,6.87 U23.2 ; 14.13,6.87 14,6.74 14,5.6 U23.1 11.73,5.6 11.45,5.88 U31.1 ; 14.13,6.87 19.21,6.87 ; 49.65,81.28 49.65,80.72 49.01,80.08 ; 49.65,81.28 55.77,81.28 56.2,81.71 56.83,81.71 56.83,78.77 57.71,77.9 63.03,77.9 63.63,78.5 63.63,79.12 ; 49.65,81.28 U17.1 ; 93.34,91.62 U16.13 78.67,92.89 ; 93.34,91.62 93.34,85.4 U35.14 ; 93.34,91.62 93.34,92.43 94.81,93.9 ; U23.14 28.1,7.87 26.97,6.74 ; 49.01,80.08 48.51,80.58 42.03,80.58 ; 49.01,80.08 49.65,79.45 U17.2 ; v1(63.79,52.34) 62.58,52.34 U1.103 ; U27.13 28.7,92.89 ; 28.7,92.89 U27.14 ; 28.7,92.89 23.62,92.89 ; 93.34,77.78 U35.8 87.44,74.41 C49.2 83.54,74.41 83.47,74.35 U39.10 ; 33.78,6.91 U12.14 ; 33.78,6.91 33.86,6.83 40.13,6.83 ; 33.78,6.91 U12.13 ; 58.9,41.01 v1(58.75,40.85) 53.81,35.92 53.81,35.08 ; 58.9,41.01 v1(58.06,41.85) ; 58.9,41.01 58.99,41.1 59.39,41.1 60.9,42.6 60.9,42.98 61.69,43.77 67.41,43.77 68.33,44.69 68.33,45.07 ; 44.92,92.76 44.92,93.06 U14.2 ; 44.92,92.76 50.29,92.76 ; 44.92,92.76 44.78,92.62 43.94,92.62 U14.1 ; 79.63,6.91 U19.8 82.09,6.83 88.3,6.83 ; 79.63,6.91 74.55,6.91 U19.14 U20.2 ; 79.63,6.91 U19.7 ; 10.86,41.38 C34.2 14.18,41.38 15,40.56 LED2.2 16.93,40.56 17.74,41.38 20.05,41.38 ; 10.86,41.38 C33.2 ; 10.86,41.38 10.68,41.38 10.49,41.57 U3.1 ; 88.52,6.03 88.52,6.62 88.3,6.83 ; 88.52,6.03 94.81,6.03 ; 88.52,6.03 U19.2 ; 68.33,45.32 68.33,45.07 ; 68.33,45.07 69.5,45.07 69.82,45.39 71.57,45.39 ; 19.18,73.02 5.54,73.02 U38.2 ; 19.18,73.02 C41.2 ; 19.18,73.02 19.18,76.26 23.13,80.2 25.25,80.2 25.79,80.75 25.79,81.48 26.16,81.85 U17.13 ; 41.46,52.78 U1.5 35.02,52.78 31.87,55.93 U25.2 U25.1 24.51,55.93 ; 41.46,52.78 41.74,52.5 41.74,49.11 41.41,48.78 U1.13 U1.14 ; C38.2 79.63,31.12 79.63,31.75 79.68,31.8 87.88,31.8 U34.2 U34.1 ; 46.37,7.02 46.4,7.05 46.4,7.13 46.47,7.2 46.47,7.75 46.62,7.9 46.62,8.18 U12.1 ; 46.37,7.02 40.21,7.02 ; 46.37,7.02 U12.2 U20.14 53.97,6.77 ; 40.13,6.83 40.21,6.91 40.21,7.02 ; 40.13,6.83 U12.8 ; U12.7 40.13,7.73 40.21,7.65 40.21,7.02 ; C42.2 18.99,86.22 17.98,87.24 ; 20.05,19.46 U9.2 ; 20.05,19.46 23.34,19.46 26.9,15.9 ; U17.14 35.79,77.93 35.79,71.3 ; U2.2 U2.2 19.94,55.93 24.51,55.93 ; 33.15,34.8 33.15,35.48 v1(32.8,35.83) ; U8.2 18.51,30.55 16.93,28.96 15.66,28.96 14.63,30 C36.2 11.3,30 10.55,29.25 U6.1 ; U20.8 59.32,6.77 53.97,6.77 ; 78.67,92.89 73.59,92.89 ; 78.67,92.89 U16.14 ; 20.05,41.38 U5.2 ; 20.05,41.38 20.73,40.69 28.7,40.69 ; U33.2 93.34,49.58 ; 42.03,80.58 U17.8 ; 42.03,80.58 U17.7 ; 26.97,6.74 U23.13 ; 26.97,6.74 21.62,6.74 U23.7 19.21,6.87 ; U34.13 U34.14 88.19,46.74 83.67,46.74 83.6,46.66 81.84,46.66 ; 88.01,13.78 88.12,13.78 88.12,9.72 88.52,9.31 U19.1 88.52,7.05 88.3,6.83 ; 88.01,13.78 88.01,17.52 ; 88.01,13.78 C35.2 ; U20.13 53.97,7.04 53.97,6.77 ; v1(3.82,40.67) 3.68,40.53 3.68,40.35 LED1.2 ; 19.21,6.87 U23.8 ; U27.1 14.73,90.49 17.98,87.24 ; U4.2 24.51,55.93 ; 73.59,92.89 U16.7 ; 73.59,92.89 U16.8 ; 68.45,72.7 69.31,72.7 69.69,73.08 U39.28 ; 68.45,72.7 68.45,73.01 ; 68.45,72.7 67.44,71.68 62.06,71.68 v1(60.78,70.41) 60.01,70.41 ; U18.8 42.26,70.16 41.11,71.3 35.79,71.3 ; 23.62,92.89 U27.7 17.98,87.24 ; 23.62,92.89 U27.8 ; 93.09,17.52 90.55,17.52 ; U20.1 68.07,9.31 68,9.39 61.66,9.39 ; 50.29,92.76 U14.8 ; 50.29,92.76 U14.7 52.73,90.33 58.02,90.33 U14.13 ; U20.7 61.66,9.39 ; 61.66,9.39 61.66,19.05 60.63,20.08 60.34,20.08 60.34,20.74 ; 90.81,70.16 93.34,70.16 ; 35.79,71.3 34.64,70.16 ; 58.81,35.08 58.81,34.23 60.34,32.7 v1(60.7,32.7) 60.7,32.48 60.87,32.31 LED5.2 61.5,31.67 68.36,24.81 73.34,24.81 ; U34.8 U34.7
  Bottom Layer w0.152: 59.56,41.01 58.88,41.01 58.88,40.99 58.79,40.89 58.79,40.85 v1(58.75,40.85) 58.75,39.25 58.16,38.67 58.16,37.3 60.7,34.77 60.7,33.2 ; 43.97,47.1 43.97,44.45 ; 43.97,47.1 43.43,47.1 43.43,48.37 42.94,48.37 42.75,48.55 42.75,49.76 44.66,51.68 45.21,51.68 45.28,51.74 45.59,51.74 ; 43.97,47.1 44.51,47.1 44.79,47.39 C27.1 ; 43.97,44.45 44.64,44.45 45.04,44.06 45.72,44.06 ; 43.97,44.45 42.63,44.45 42.63,39.07 43.61,38.1 ; U19.14 U19.13 ; 29.97,41.46 29.97,47.04 ; 29.97,41.46 29.47,41.46 28.7,40.69 ; 29.97,41.46 30.47,41.46 31.24,40.69 32.8,39.13 v1(32.8,35.83) ; 29.97,47.04 U25.7 27.43,49.58 27.43,53.82 28.42,54.8 28.7,54.8 U25.1 ; 29.97,47.04 U25.8 ; U33.8 91.94,57.2 ; 91.94,57.2 91.94,50.74 90.81,49.61 U33.2 90.81,44.12 U34.14 ; 91.94,57.2 93.34,57.2 ; 91.94,57.2 91.94,63.69 ; 94.36,18.79 95.63,17.52 ; 94.36,18.79 93.09,17.52 ; 94.36,18.79 94.36,26.73 93.47,27.62 U34.1 93.47,29.89 93.75,29.89 94.71,30.84 94.71,35.14 U34.7 94.61,37.51 94.61,42.86 U34.13 ; 40.84,83.03 35.59,83.03 ; 40.84,83.03 U17.7 ; 40.84,83.03 40.84,87.26 43.94,90.36 U14.1 ; 35.59,83.03 35.59,86 U27.13 ; 35.59,83.03 U17.13 U17.14 ; 26.9,15.9 28.1,14.7 28.1,8.18 ; v1(58.06,41.85) 57.41,42.5 56.6,42.5 ; 93.34,64.82 92.21,63.69 91.94,63.69 ; 56.91,51.74 C6.2 ; 56.91,51.74 57.28,51.37 57.28,48.83 58.19,48.83 58.75,48.27 58.75,48.25 59.44,48.25 59.44,47.62 60.07,47.62 60.12,47.57 60.12,46.3 59.49,45.67 58.44,45.67 57.26,44.5 ; 56.91,51.74 56.91,53.9 58.34,53.9 ; 18.71,40.67 U5.2 ; 18.71,40.67 v1(3.82,40.67) ; 18.71,40.67 21.31,38.07 21.31,31.82 U8.2 18.81,29.32 18.81,21.73 U9.2 ; 60.78,61.15 56.94,61.15 56.55,60.75 56.55,60.09 55.61,60.09 ; 60.78,61.15 v1(60.78,70.41) ; 60.78,61.15 60.79,61.15 61.16,60.78 61.16,58.07 ; 43.43,38.09 43.45,38.1 43.61,38.1 ; U16.8 71.12,92.96 65.91,92.96 ; C23.1 57.26,44.5 ; 57.26,44.5 57.26,43.59 57.01,43.59 56.6,43.18 56.6,42.75 ; 90.81,70.16 U33.14 91.94,63.69 ; U20.2 U20.1 ; 45.59,51.74 45.59,52.98 45.58,52.99 C3.1 49.88,58.2 U18.2 49.88,71.29 49.65,71.52 U17.2 ; 45.59,51.74 C4.2 ; 43.61,38.1 C31.1 45.7,37.16 46.99,35.87 49.17,35.87 ; 14.73,93.91 U29.1 ; 14.73,93.91 U27.2 ; 14.73,93.91 U27.1 ; 61.16,58.07 64.3,58.07 65.54,56.83 67.16,56.83 67.56,57.23 68.47,57.23 ; 61.16,58.07 58.34,55.26 58.34,53.9 ; 59.38,52.5 59.38,52.62 ; 59.38,52.62 59.38,52.82 58.34,53.86 58.34,53.9 ; 59.38,52.62 63.5,52.62 v1(63.79,52.34) 66.48,52.34 67.31,51.51 67.31,48.64 C13.1 ; 59.18,91.62 U14.13 ; 59.18,91.62 U14.14 ; 59.18,91.62 U16.1 65.84,91.62 65.91,91.69 65.91,92.96 ; 93.34,85.4 94.48,84.26 94.48,81.61 94.46,81.59 94.46,81.23 94.48,81.22 94.48,78.91 93.34,77.78 94.53,76.59 94.53,72.18 93.63,71.29 93.34,71.29 93.34,70.16 ; 50.95,30.06 50.95,30.97 51.29,31.31 51.29,32.09 50.66,32.09 50.66,34.38 49.17,35.87 ; 60.7,33.2 v1(60.7,32.7) ; 60.7,33.2 C40.2 64.88,33.2 65.32,32.76 C39.1 ; U16.2 65.91,92.96 ; 56.6,42.75 54,42.75 53.38,42.14 53.38,41.19 53.13,40.93 51.62,40.93 50.74,40.06 50.42,40.06 ; 56.6,42.75 56.6,42.5 ; 90.55,17.52 88.01,17.52 ; C26.2 50.42,40.06 ; 50.42,40.06 C25.1 50.42,37.11 49.17,35.87 ; U20.8 U20.7 ; 28.1,8.18 U23.14 ; 28.1,8.18 U12.13 ; 56.6,42.24 56.6,42.5 ; U18.14 34.64,70.16
CRESET_B: length 51.5
  Top Layer w0.152: 95.63,20.06 95.54,20.15 R8.1 95.54,28.83 94.34,30.02 90.58,30.02 87.06,33.54 64.09,33.54 60.95,36.68 57.91,36.68 57.31,36.09 57.31,35.08
GBIN0: length 58.4
  Top Layer w0.152: 50.31,56.97 50.31,55.98 49.31,54.98 v1(45.3,54.98)
  Bottom Layer w0.152: v1(45.3,54.98) 44.89,54.98 44.02,54.11 44.02,51.73 42.42,50.13 42.42,44.75 42.32,44.64 42.32,11.18 43.81,9.69 43.81,7.05 U12.4
GBIN1: length 57
  Top Layer w0.152: v1(40.83,33.14) 40.83,16.67 45.21,12.28 U12.3 ; v1(41.95,47.35) 42.51,47.91 42.51,51.52 44.08,53.1 47.89,53.1 50.81,56.02 50.81,56.97
  Bottom Layer w0.152: v1(41.95,47.35) 40.83,46.23 v1(40.83,33.14)
GBIN2: length 60.8
  Top Layer w0.152: U1.94 46.37,47.78 v1(41.87,43.28)
  Bottom Layer w0.152: U12.6 41.44,6.87 41.44,42.86 v1(41.87,43.28)
GBIN3: length 57
  Top Layer w0.152: v1(41.88,42.15) 47,47.27 62.51,47.27
  Bottom Layer w0.152: v1(41.88,42.15) 41.88,8.97 U12.5
GBIN4: length 42.6
  Top Layer w0.152: 50.31,35.08 50.31,34.22 v1(49.52,33.43)
  Bottom Layer w0.152: U12.10 38.74,4.49 45.84,4.49 46.59,5.24 46.59,10.95 51.22,15.58 51.22,25.49 49.52,27.19 v1(49.52,33.43)
GBIN5: length 32.7
  Top Layer w0.152: U12.9 v1(42.85,13.44) ; v1(48.8,33.82) 48.81,33.83 48.81,35.08
  Bottom Layer w0.152: v1(48.8,33.82) 48.74,33.87 46.89,33.87 42.85,29.84 v1(42.85,13.44)
GBIN6: length 43.6
  Top Layer w0.152: v1(36.68,44.61) 36.84,44.78 U1.21
  Bottom Layer w0.152: v1(36.68,44.61) 36.68,40.23 36.39,39.94 36.39,6.98 U12.12
GBIN7: length 53.3
  Top Layer w0.152: v1(36.25,45.24) 40.57,45.24 U1.20 ; U12.11 38.64,11.77 38.64,16.59 38.29,16.93 37.97,16.93 R16.2
  Bottom Layer w0.152: U12.11 36.08,9.21 36.08,40.07 36.21,40.19 36.21,45.19 v1(36.25,45.24)
IOB_56: length 85.1
  Top Layer w0.152: 42.81,35.08 41.31,35.08 36.34,30.11 36.34,30.1 35.65,29.4 v1(25.8,29.4)
  Bottom Layer w0.152: v1(25.8,29.4) 25.29,29.9 25.29,40.99 22.43,43.86 22.43,72.44 17.27,77.59 U27.3
IOB_57: length 34.7
  Top Layer w0.152: 43.31,35.08 43.31,15.37 44.39,14.3 49.25,14.3 U20.11
IOB_61: length 35.3
  Top Layer w0.152: v1(52.28,27.63) 50.4,27.63 43.81,34.22 43.81,35.08
  Bottom Layer w0.152: U20.12 54.19,6.82 54.19,23.31 52.28,25.23 v1(52.28,27.63)
IOB_63: length 34.6
  Top Layer w0.152: 44.81,35.08 44.81,33.74 50.36,28.19 54.14,28.19 v1(54.17,28.22)
  Bottom Layer w0.152: v1(54.17,28.22) 54.88,27.51 54.88,14.21 57.91,11.18 U20.9
IOB_64: length 35.7
  Top Layer w0.152: v1(52.22,28.62) 50.51,28.62 45.31,33.82 45.31,35.08
  Bottom Layer w0.152: v1(52.22,28.62) 52.79,28.06 52.79,26.34 54.54,24.59 54.54,12.8 56.64,10.7 56.64,6.91 U20.10
IOB_71: length 36.8
  Top Layer w0.152: v1(56.86,27.81) 53.5,31.17 48.66,31.17 45.81,34.02 45.81,35.08
  Bottom Layer w0.152: U20.5 57.89,13.28 57.89,26.78 v1(56.86,27.81)
IOB_72: length 38.4
  Top Layer w0.152: 46.31,35.08 46.31,34.23 v1(47.1,33.44) ; v1(55.95,19.49) 54.17,21.28 v1(50.64,21.28)
  Bottom Layer w0.152: v1(55.95,19.49) 55.95,14.39 61.72,8.62 61.72,6.91 U20.6 ; v1(47.1,33.44) 48.64,31.9 48.64,23.27 v1(50.64,21.28)
IOB_73: length 56.3
  Top Layer w0.152: v1(60.44,42.84) 53.19,42.84 46.81,36.47 46.81,35.08
  Bottom Layer w0.152: U20.3 65.94,8.59 65.94,26.69 67.23,27.98 67.23,35.75 67.19,35.79 66.47,35.79 65.58,36.69 65.58,36.91 60.44,42.05 v1(60.44,42.84)
IOB_79: length 40.2
  Top Layer w0.152: 47.81,35.08 47.81,33.74 49.96,31.59 v1(55.46,31.59)
  Bottom Layer w0.152: U20.4 64.26,6.91 64.26,14.03 60.66,17.63 60.66,26.74 55.8,31.59 v1(55.46,31.59)
IOB_80: length 51.2
  Top Layer w0.152: 48.31,35.08 48.31,33.68 49.33,32.66 51.84,32.66 v1(51.96,32.78) ; v1(53.22,17.86) 59.18,11.89 59.18,7.74 60.01,6.91 74.02,6.91 75.29,8.18 75.82,8.18
  Bottom Layer w0.152: v1(51.96,32.78) 51.96,29.09 51.79,28.92 51.79,27.5 51.96,27.33 51.96,19.11 v1(53.22,17.86)
IOB_91: length 55.7
  Top Layer w0.152: 51.81,35.08 51.81,34.2 50.7,33.09 v1(50.01,33.09)
  Bottom Layer w0.152: v1(50.01,33.09) 50.01,28.58 51.54,27.05 51.54,7.82 52.44,6.91 53.26,6.91 54.24,5.93 54.24,5.14 54.97,4.41 74.59,4.41 75.82,5.64
IOB_94: length 40.7
  Top Layer w0.152: v1(63.21,19.8) 65.64,17.37 69.17,17.37 U19.9 ; v1(55.16,32.09) 54.22,32.09 52.31,34 52.31,35.08
  Bottom Layer w0.152: v1(63.21,19.8) 63.21,24.64 55.76,32.09 v1(55.16,32.09)
IOB_95: length 42.7
  Top Layer w0.152: v1(66.44,24.82) 63.44,27.82 57.77,27.82 55.91,29.68 55.91,32.22 54.31,33.82 54.31,35.08
  Bottom Layer w0.152: v1(66.44,24.82) 77.09,14.17 77.09,6.91 U19.10
IOB_96: length 43.4
  Top Layer w0.152: v1(64.11,19.66) 71.96,19.66 U19.5 ; v1(56.07,32.68) 54.81,33.93 54.81,35.08
  Bottom Layer w0.152: v1(64.11,19.66) 63.66,20.11 63.66,25.09 v1(56.07,32.68)
IOB_102: length 44.6
  Top Layer w0.152: 55.31,35.08 55.31,34.05 56.5,32.86 56.5,29.63 57.83,28.31 63.75,28.31 v1(67.12,24.95)
  Bottom Layer w0.152: U19.6 82.03,7.05 82.03,10.03 v1(67.12,24.95)
IOB_103: length 44.9
  Top Layer w0.152: 55.81,35.08 55.81,34.03 56.99,32.86 v1(56.99,32.81) ; U19.3 74.07,20.09 v1(64.65,20.09)
  Bottom Layer w0.152: v1(56.99,32.81) 64.15,25.65 64.15,20.59 v1(64.65,20.09)
IOB_104: length 70.8
  Top Layer w0.152: 56.31,35.08 56.31,37.37 v1(61.16,42.22)
  Bottom Layer w0.152: v1(61.16,42.22) 61.16,46.91 63.76,49.51 64.2,49.51 64.91,48.8 64.91,39.01 67.93,35.99 67.93,25.77 84.71,8.99 84.71,6.91 U19.4
IOL_2A: length 27.8
  Top Layer w0.152: U13.9 25.14,74.57 v1(24.56,73.99) ; v1(26.42,69.14) 40.61,54.95 U1.1
  Bottom Layer w0.152: v1(26.42,69.14) 26.42,72.13 v1(24.56,73.99)
IOL_2B: length 32.5
  Top Layer w0.152: 40.61,54.27 41.43,54.27 41.86,54.71 41.86,55.72 31.05,66.54 31.05,71.55 28.84,73.75 28.84,73.99 25.97,76.86 24.96,76.86 24.49,76.39 U13.8
IOL_3A: length 34.6
  Top Layer w0.152: U13.7 23.84,76.47 24.55,77.18 26.09,77.18 29.15,74.12 29.15,73.88 31.47,71.56 31.47,66.72 42.2,55.99 42.2,54.42 41.55,53.77 40.61,53.77
IOL_3B: length 30.1
  Top Layer w0.152: 40.61,53.27 39.82,53.27 38.36,54.73 38.36,56.28 v1(24.16,70.48) ; U13.6 23.19,74.7 v1(23.9,73.99)
  Bottom Layer w0.152: v1(23.9,73.99) 23.9,70.73 v1(24.16,70.48)
IOL_4A: length 34.8
  Top Layer w0.152: v1(23,74.07) 22.54,74.53 22.54,75.74 ; v1(32.63,53.96) 34.69,51.9 40.49,51.9 U1.7
  Bottom Layer w0.152: v1(23,74.07) 23.37,73.71 23.37,66.93 32.63,57.66 v1(32.63,53.96)
IOL_4B: length 33.4
  Top Layer w0.152: U1.8 40.5,51.38 v1(38.8,51.38) ; v1(21.69,74.12) 21.89,74.32 21.89,75.74 ; v1(35.11,57.72) 22.87,69.96 v1(22.87,70.5)
  Bottom Layer w0.152: v1(21.69,74.12) 22.87,72.93 v1(22.87,70.5) ; v1(35.11,57.72) 38.8,54.03 v1(38.8,51.38)
IOL_5A: length 39.6
  Top Layer w0.152: v1(29.59,74.06) 29.59,74.13 26.2,77.51 22.3,77.51 21.24,76.45 21.24,75.74 ; 40.61,50.77 40.6,50.77 v1(39.34,50.77)
  Bottom Layer w0.152: v1(29.59,74.06) 29.59,71.06 39.34,61.31 v1(39.34,50.77)
IOL_5B: length 39.6
  Top Layer w0.152: 19.94,75.74 19.94,72.11 21.13,70.93 v1(28.96,70.93) ; v1(37.72,51.45) 38.89,50.27 40.61,50.27
  Bottom Layer w0.152: v1(37.72,51.45) 34.67,54.49 34.67,65.21 v1(28.96,70.93)
IOL_8A: length 10.9
  Top Layer w0.152: U25.4 34.86,49.77 40.61,49.77
IOL_8B: length 13.6
  Top Layer w0.152: U1.12 34.82,49.28 31.97,52.12 29.97,52.12 U25.3
IOL_10A: length 10.6
  Top Layer w0.152: U25.6 34.32,47.78 U1.15
IOL_10B: length 13.4
  Top Layer w0.152: U25.5 29.97,49.58 31.69,49.58 33.99,47.27 40.61,47.27
IOL_12A: length 9.8
  Top Layer w0.152: 40.61,46.77 v1(33.01,46.77)
  Bottom Layer w0.152: 31.24,45.77 32.01,45.77 v1(33.01,46.77)
IOL_12B: length 12.6
  Top Layer w0.152: 40.61,46.27 32.35,46.27 31.71,46.91 29.84,46.91 28.7,45.77
IOL_13A: length 10.4
  Top Layer w0.152: U1.19 34.12,45.78 v1(33.01,44.66)
  Bottom Layer w0.152: v1(33.01,44.66) 32.67,44.66 U25.12
IOL_14B: length 12.5
  Top Layer w0.152: 40.61,44.27 40.51,44.17 32.89,44.17 32.69,44.37 29.84,44.37 U25.11
IOL_17A: length 48
  Top Layer w0.152: U23.4 18.65,11.39 v1(18.65,13.51) ; v1(35.38,41.81) 37.34,43.77 40.61,43.77
  Bottom Layer w0.152: v1(35.38,41.81) 34.31,40.74 34.31,35.85 22.01,23.56 22.01,16.86 v1(18.65,13.51)
IOL_17B: length 50
  Top Layer w0.152: v1(33.69,39.52) 33.7,39.52 37.45,43.27 40.61,43.27
  Bottom Layer w0.152: v1(33.69,39.52) 33.69,36.08 21.32,23.7 21.32,18.41 16.67,13.77 16.67,6.87 U23.3
IOL_18A: length 45.4
  Top Layer w0.152: U1.25 38.23,42.78 v1(35.48,40.03)
  Bottom Layer w0.152: v1(35.48,40.03) 35.1,39.64 35.1,36.16 22.92,23.98 22.92,13.12 U23.6
IOL_18B: length 59.4
  Top Layer w0.152: v1(39.3,41.89) 39.68,42.28 U1.26
  Bottom Layer w0.152: v1(39.3,41.89) 39.66,41.53 39.66,22.4 38.86,21.6 38.86,7.78 37.99,6.91 37.2,6.91 36.35,6.06 36.35,5.29 35.41,4.35 19.2,4.35 U23.5
IOL_23A: length 41.2
  Top Layer w0.152: U1.28 39.38,41.28 v1(39.21,41.11) ; v1(38.51,28.64) 38.51,23.63 U23.10
  Bottom Layer w0.152: v1(39.21,41.11) 39.31,41.01 39.31,29.45 v1(38.51,28.64)
IOL_23B: length 44.6
  Top Layer w0.152: v1(35.55,39.33) 36.86,40.65 40.49,40.65 40.61,40.77
  Bottom Layer w0.152: U23.9 24.18,6.76 24.18,24.72 35.55,36.09 v1(35.55,39.33)
IOL_24A: length 39
  Top Layer w0.152: v1(35.58,35.48) 35.58,36.76 38.59,39.77 40.61,39.77
  Bottom Layer w0.152: U23.12 25.56,25.47 v1(35.58,35.48)
IOL_24B: length 42.2
  Top Layer w0.152: v1(35.5,30.45) 41.89,36.84 41.89,38.86 41.47,39.28 U1.32
  Bottom Layer w0.152: v1(35.5,30.45) 25.89,20.84 25.89,13.92 26.83,12.98 26.83,6.87 U23.11
IOL_25A: length 68.9
  Top Layer w0.152: v1(38.47,38.99) 38.69,38.78 U1.33
  Bottom Layer w0.152: U27.6 21.08,92.89 23.62,92.89 24.48,93.75 ; U27.10 24.48,93.75 ; 24.48,93.75 26.16,92.06 26.16,89.59 27.85,87.9 27.85,64.98 33.42,59.41 33.42,55.02 37.42,51.02 37.42,40.17 38.47,39.12 v1(38.47,38.99)
IOL_25B: length 66.8
  Top Layer w0.152: v1(38.07,38.26) 40.59,38.26 U1.34
  Bottom Layer w0.152: 23.62,90.35 27.47,86.5 27.47,63.53 33.09,57.91 33.09,49.8 37.11,45.78 37.11,39.22 v1(38.07,38.26) ; 23.62,90.35 21.08,90.35 U27.5 ; 23.62,90.35 U27.9
IOR_108: length 58.4
  Top Layer w0.152: v1(85.62,37.26) 83.6,35.23 80.09,35.23 79.55,34.69 65.11,34.69 64.11,35.69 64.1,35.69 62.51,37.27 ; U39.1 83.47,62.92 83.47,59.91 88.53,54.85 v1(88.53,52.35) 90.57,52.35 U33.4
  Bottom Layer w0.152: v1(88.53,52.35) 88.53,43.27 86.71,41.45 86.57,41.45 85.62,40.5 v1(85.62,37.26)
IOR_110: length 63
  Top Layer w0.152: U1.74 63.3,37.78 65.12,35.96 79.55,35.96 80.09,36.5 83.6,36.5 85.53,38.43 v1(88.16,38.43) ; U39.2 83.96,64.19 84.56,63.59 84.56,59.31 89.64,54.23 89.64,54.02 90.27,53.39 92.08,53.39 93.34,52.12
  Bottom Layer w0.152: v1(88.16,38.43) 88.16,40.31 90.57,42.72 91.33,42.72 92.2,43.59 92.2,50.57 93.34,51.71 93.34,52.12
IOR_111: length 58.8
  Top Layer w0.152: U1.75 63.31,38.28 64.36,37.23 79.55,37.23 80.09,37.77 83.6,37.77 84.3,38.47 v1(84.47,38.47) ; U39.3 83.82,65.46 88.06,61.22 v1(88.06,56.54) 88.93,56.54 U33.6
  Bottom Layer w0.152: v1(88.06,56.54) 84.47,52.95 v1(84.47,38.47)
IOR_112: length 68.5
  Top Layer w0.152: U1.76 67.65,38.78 67.93,38.5 79.55,38.5 80.09,39.04 88.16,39.04 89.53,37.66 93.95,37.66 94.85,38.57 v1(94.85,43.23) ; U39.4 82.99,66.73 88.65,61.07 88.65,60.19 90.36,58.47 91.2,58.47 92.08,57.6 92.08,55.93 93.34,54.66
  Bottom Layer w0.152: v1(94.85,43.23) 94.85,53.15 93.34,54.66
IOR_114: length 58.3
  Top Layer w0.152: v1(86.12,40.34) 83.62,40.34 83.6,40.31 80.09,40.31 79.81,40.03 73.87,40.03 73.48,39.64 64.31,39.64 64.18,39.77 62.51,39.77 ; U33.10 83.47,67.08 83.47,68 U39.5
  Bottom Layer w0.152: v1(86.12,40.34) 89.44,43.65 89.44,58.37 U33.10
IOR_115: length 74
  Top Layer w0.152: v1(84.04,51.8) 83.66,51.8 83.6,51.74 v1(77.9,51.74) ; 93.34,59.74 92.08,61.01 90.21,61.01 v1(89.04,62.18) ; v1(87.2,75.63) 83.47,79.35 83.47,79.43 U39.14 ; v1(65.54,40.79) 64.07,40.79 63.55,40.27 62.51,40.27
  Bottom Layer w0.152: v1(77.9,51.74) 77.9,43.98 76.96,43.04 76.96,40.72 73.75,37.52 68.82,37.52 v1(65.54,40.79) ; v1(87.2,75.63) 87.2,64.03 v1(89.04,62.18) 84.04,57.18 v1(84.04,51.8)
IOR_116: length 123.7
  Top Layer w0.152: 62.51,40.77 61.65,40.77 61.22,40.34 61.22,37.16 64.37,34.01 88.38,34.01 89.82,32.56 93.85,32.56 95.7,34.42 95.7,61.62 93.77,63.55 ; v1(87.9,54.83) 80.1,54.83 80.09,54.81 80.09,53.67 80.74,53.01 81.84,53.01 ; U39.15 86.18,80.7 87.83,79.05 93.7,79.05 94.52,78.22 94.52,64.3 93.77,63.55 ; 93.77,63.55 92.08,63.55 U33.12
  Bottom Layer w0.152: v1(87.9,54.83) 88.9,55.82 88.9,60.38 U33.12
IOR_117: length 92.6
  Top Layer w0.152: v1(67.03,41.33) 66.98,41.28 U1.81 ; 85.8,51.81 83.92,49.93 69.96,49.93 v1(68.03,48) ; 85.8,51.81 85.8,52.08 83.6,54.28 81.84,54.28 ; 85.8,51.81 86.62,50.98 93.94,50.98 94.54,51.58 94.54,61.09 93.34,62.28 ; U39.16 83.79,81.97 85.95,84.13 93.7,84.13 94.89,82.93 v1(94.89,81.41)
  Bottom Layer w0.152: 93.34,62.28 94.89,63.83 v1(94.89,81.41) ; v1(68.03,48) 68.03,45.71 66.92,44.59 66.92,41.44 v1(67.03,41.33)
IOR_118: length 80.3
  Top Layer w0.152: v1(78.95,79.49) 78.95,82.22 79.96,83.24 U39.17 ; v1(78.7,41.74) 77.87,40.91 68.76,40.91 67.9,41.78 U1.82 ; v1(78.86,55.55) 81.84,55.55
  Bottom Layer w0.152: U34.4 90.17,31.29 79.72,41.74 v1(78.7,41.74) 78.65,41.79 78.65,42.45 78.86,42.67 v1(78.86,55.55) 78.77,55.65 78.77,74.23 78.86,74.33 78.86,79.42 v1(78.95,79.49)
IOR_119: length 83.8
  Top Layer w0.152: v1(83.65,82.43) 83.47,82.62 83.47,84.51 U39.18 ; v1(79.08,42.27) 62.51,42.27 U1.83 ; v1(80.38,57.49) 80.13,57.49 80.09,57.44 80.09,56.82 81.84,56.82
  Bottom Layer w0.152: 80.38,42.27 v1(80.38,57.49) 83.06,60.17 83.06,81.84 v1(83.65,82.43) ; 80.38,42.27 v1(79.08,42.27) ; 80.38,42.27 80.38,41.88 89.67,32.59 92.17,32.59 U34.3
IOR_120: length 79.9
  Top Layer w0.152: U39.20 73.2,83.24 75.7,80.74 v1(75.7,79.81) ; 71.57,55.55 73.33,55.55 73.35,55.53 v1(75.7,55.53) ; U1.84 69.12,42.78 69.92,43.58 74.31,43.58 v1(75.34,44.61) 77.1,42.84 v1(77.39,42.84) ; U34.6 89.28,35.49 v1(84.48,35.49)
  Bottom Layer w0.152: v1(75.34,44.61) 75.34,45.13 76.09,45.88 76.09,48.86 75.7,49.24 v1(75.7,55.53) v1(75.7,79.81) ; v1(77.39,42.84) 77.39,42.43 84.33,35.49 v1(84.48,35.49)
IOR_128: length 89.2
  Top Layer w0.152: U39.21 73.2,81.97 73.2,81.48 v1(75.12,79.56) ; v1(74.29,45.18) 73.88,44.77 69.9,44.77 68.4,43.27 62.51,43.27 ; 71.57,54.28 73.33,54.28 73.54,54.07 v1(75.12,54.07) ; U34.5 95.31,35.67 95.31,43.97 93.97,45.31 92.2,45.31 88.85,48.65 v1(75.46,48.65)
  Bottom Layer w0.152: v1(75.12,79.56) v1(75.12,54.07) 75.12,48.99 v1(75.46,48.65) 75.46,45.69 74.95,45.18 v1(74.29,45.18)
IOR_136: length 74.9
  Top Layer w0.152: v1(73.27,78.82) 73.81,79.36 73.81,80.09 73.2,80.7 U39.22 ; v1(73.95,39.5) 74.03,39.59 90.26,39.59 U34.10 ; v1(73.34,53.62) 73.34,53.02 73.33,53.01 69.82,53.01 69.82,52.95 68.85,51.98 v1(68.48,51.98) ; 62.51,44.27 67.28,44.27 v1(67.35,44.34)
  Bottom Layer w0.152: 67.87,44.21 67.87,42.76 71.14,39.5 v1(73.95,39.5) ; 67.87,44.21 68.48,44.82 v1(68.48,51.98) ; 67.87,44.21 67.48,44.21 v1(67.35,44.34) ; v1(73.27,78.82) 73.27,53.68 v1(73.34,53.62)
IOR_137: length 72.7
  Top Layer w0.152: U39.23 73.2,79.43 73.29,79.52 v1(73.34,79.52) ; U1.88 66.6,44.78 67.78,45.95 73.82,45.95 v1(73.86,45.91) 74.17,45.91 74.66,45.42 75.21,45.42 77.26,43.37 78.4,43.37 79.08,42.71 79.26,42.71 79.51,42.45 79.51,41.71 80.18,41.04 86.8,41.04 87.52,40.32 92.06,40.32 U34.9 ; 71.57,51.74 73.33,51.74 73.34,51.73 v1(73.66,51.73)
  Bottom Layer w0.152: v1(73.86,45.91) 73.66,46.12 v1(73.66,51.73) 73.77,51.85 73.77,53.84 73.71,53.9 73.71,79.15 v1(73.34,79.52)
IOR_138: length 68.9
  Top Layer w0.152: v1(75.02,45.85) 75.35,45.85 76.48,44.73 83.52,44.73 83.6,44.65 83.6,43.78 85.02,42.35 90.03,42.35 U34.12 ; U39.24 v1(74.15,78.16) ; v1(65.46,49.73) 66.2,50.47 73.33,50.47 ; v1(65.4,46.84) 65.4,46.77 64.4,45.78 U1.90 ; v1(74.12,50.47) 73.33,50.47
  Bottom Layer w0.152: v1(65.46,49.73) 65.46,46.9 v1(65.4,46.84) ; v1(75.02,45.85) 74.12,46.75 v1(74.12,50.47) 74.15,50.5 v1(74.15,78.16)
IOR_139: length 72.1
  Top Layer w0.152: U34.11 92.2,42.72 90.09,42.72 86.85,45.97 v1(76.61,45.97) ; v1(69.56,68) U39.32 ; v1(73.72,40.47) 73.48,40.47 73.33,40.31 v1(64.25,40.31) ; 62.51,46.27 v1(64.25,46.27)
  Bottom Layer w0.152: v1(69.56,68) 70.05,67.5 70.05,45.82 73.61,42.26 ; v1(64.25,46.27) v1(64.25,40.31) ; v1(73.72,40.47) 73.72,42.15 73.61,42.26 ; v1(76.61,45.97) 76.61,45.5 75.77,44.67 75.77,44.43 73.61,42.26
IOR_144: length 61.9
  Top Layer w0.152: 71.57,39.04 69.82,39.04 69.77,38.99 v1(68.21,38.99) ; v1(69.46,66.73) U39.33 77.46,66.73 79.94,69.21 79.94,69.7 80.24,69.99 88.1,69.99 U35.4 ; v1(66.08,46.6) 66.08,46.78 64.6,48.26 62.53,48.26 U1.95
  Bottom Layer w0.152: v1(68.21,38.99) 66.08,41.13 v1(66.08,46.6) 67.6,48.12 67.6,48.18 67.91,48.49 67.91,52.6 69.46,54.15 v1(69.46,66.73)
IOR_146: length 74.7
  Top Layer w0.152: 93.34,72.7 92.08,71.43 90.07,71.43 87.19,68.54 79.95,68.54 v1(76.73,65.33) 76.61,65.46 U39.34 ; 71.57,37.77 73.33,37.77 v1(73.59,38.03) ; U1.96 63.53,48.78 63.74,48.57 64.89,48.57 66.57,46.89 v1(66.57,46.29)
  Bottom Layer w0.152: 73.59,38.45 69.58,38.45 68.01,40.03 67.7,40.03 66.57,41.16 v1(66.57,46.29) ; 73.59,38.45 v1(73.59,38.03) ; 73.59,38.45 76.65,41.5 76.65,44.03 77.05,44.42 77.05,46.21 76.73,46.52 v1(76.73,65.33)
IOR_147: length 78.1
  Top Layer w0.152: v1(63.3,57.64) 69.69,64.04 69.69,64.19 U39.35 76.41,64.19 v1(79.72,67.5) ; v1(63.89,49.02) 63.64,49.28 U1.97 56.15,49.28 55.35,50.08 55.35,50.66 56.3,51.62 57.87,51.62 v1(59.7,53.44) ; v1(79.88,73.77) 89.34,73.77 90.81,75.24 ; v1(66.41,36.62) 69.7,36.62 69.82,36.5 71.57,36.5
  Bottom Layer w0.152: v1(63.3,57.64) 59.7,54.04 v1(59.7,53.44) ; v1(63.89,49.02) 63.65,48.78 63.65,39.39 v1(66.41,36.62) ; v1(79.72,67.5) 79.88,67.66 v1(79.88,73.77)
IOR_148: length 66.5
  Top Layer w0.152: 81.84,41.58 83.6,41.58 83.73,41.71 86.01,41.71 86.18,41.88 v1(86.44,41.88) ; 62.51,49.77 64.8,49.77 67.19,47.39 86.21,47.39 v1(86.44,47.61)
  Bottom Layer w0.152: 93.34,75.24 91.94,73.83 91.94,72.15 91.07,71.29 90.21,71.29 89.57,70.65 89.57,62.09 88.53,61.06 88.53,56.09 86.44,54 v1(86.44,47.61) v1(86.44,41.88)
IOR_152: length 54.6
  Top Layer w0.152: 62.51,50.27 65.4,50.27 66.14,51.02 79.54,51.02 80.09,50.47 v1(83.72,50.47)
  Bottom Layer w0.152: v1(83.72,50.47) 83.61,50.59 83.61,63.5 85.73,65.62 85.73,75.24 U35.10
IOR_160: length 63.7
  Top Layer w0.152: 69.01,52.94 69.01,55.26 69.84,56.1 73.03,56.1 78.45,61.51 78.45,61.84 80.07,63.46 84.07,63.46 v1(84.13,63.41) ; 69.01,52.94 v1(69.1,52.84) ; 69.01,52.94 67.94,52.94 66.4,51.4 62.64,51.4 U1.101 ; v1(69.5,41.75) 69.67,41.58 71.57,41.58
  Bottom Layer w0.152: 93.34,80.32 92.08,79.05 89.98,79.05 86.3,75.36 86.3,65.59 v1(84.13,63.41) ; v1(69.5,41.75) 69.5,52.45 v1(69.1,52.84)
IOR_161: length 51.1
  Top Layer w0.152: U1.102 64.37,51.78 70.62,58.03 73.23,58.03 79.95,64.76 v1(83.61,64.76) ; U39.6 83.47,69.27 83.53,69.32 v1(84.35,69.32) 85.26,69.32
  Bottom Layer w0.152: v1(83.61,64.76) 83.61,68.59 v1(84.35,69.32) 84.35,76.4 U35.12
IOR_164: length 72.4
  Top Layer w0.152: U1.104 63.62,52.78 69.2,58.36 72.56,58.36 v1(77.23,63.02) ; 93.34,82.86 92.08,81.59 83.59,81.59 83.31,81.31 80.15,81.31 79.96,81.12 79.96,78.16 U39.13
  Bottom Layer w0.152: v1(77.23,63.02) 77.23,65.81 77,66.04 77,78.17 82.95,84.13 92.08,84.13 93.34,82.86
IOR_165: length 93.6
  Top Layer w0.152: U39.31 68.9,69.27 65.92,66.29 v1(56.18,66.29) ; v1(55.86,55.65) 56,55.5 61.16,55.5 61.24,55.59 63.1,55.59 63.64,55.04 63.64,53.56 63.36,53.27 62.51,53.27
  Bottom Layer w0.152: 56.17,66.29 54.67,64.79 54.67,56.84 v1(55.86,55.65) ; 56.17,66.29 56.17,77.54 50.06,83.66 50.06,84.79 50.22,84.96 50.22,94.64 49.48,95.37 28.65,95.37 U27.12 ; 56.17,66.29 v1(56.18,66.29)
IOR_166: length 65.2
  Top Layer w0.152: v1(43.85,54.55) 44.51,53.89 v1(44.51,53.53) ; 62.51,53.77 60.26,53.77 60.13,53.91 58.42,53.91 56.64,52.12 v1(44.8,52.12)
  Bottom Layer w0.152: U27.11 32.34,86.71 32.34,77.88 38.45,71.77 38.45,66.44 43.85,61.05 v1(43.85,54.55) ; v1(44.51,53.53) 44.51,52.42 v1(44.8,52.12)
IOT168: length 68.2
  Top Layer w0.152: v1(77.41,44.18) 78.11,44.18 79.28,43.02 79.92,43.02 80.09,42.85 81.84,42.85 ; U39.7 79.96,70.54 79.63,70.21 79.63,69.51 v1(77.48,67.36) 77.44,67.32 v1(68.89,67.32) 68.89,66.93 59.81,57.85 59.81,56.97 ; v1(64.56,74.13) 64.21,74.49 63.46,74.49 62.98,74 U15.9
  Bottom Layer w0.152: v1(68.89,67.32) 64.56,71.65 v1(64.56,74.13) ; v1(77.41,44.18) 77.41,57.53 77.74,57.86 77.74,67.1 v1(77.48,67.36)
